# Altium project Salty32.PrjPcb
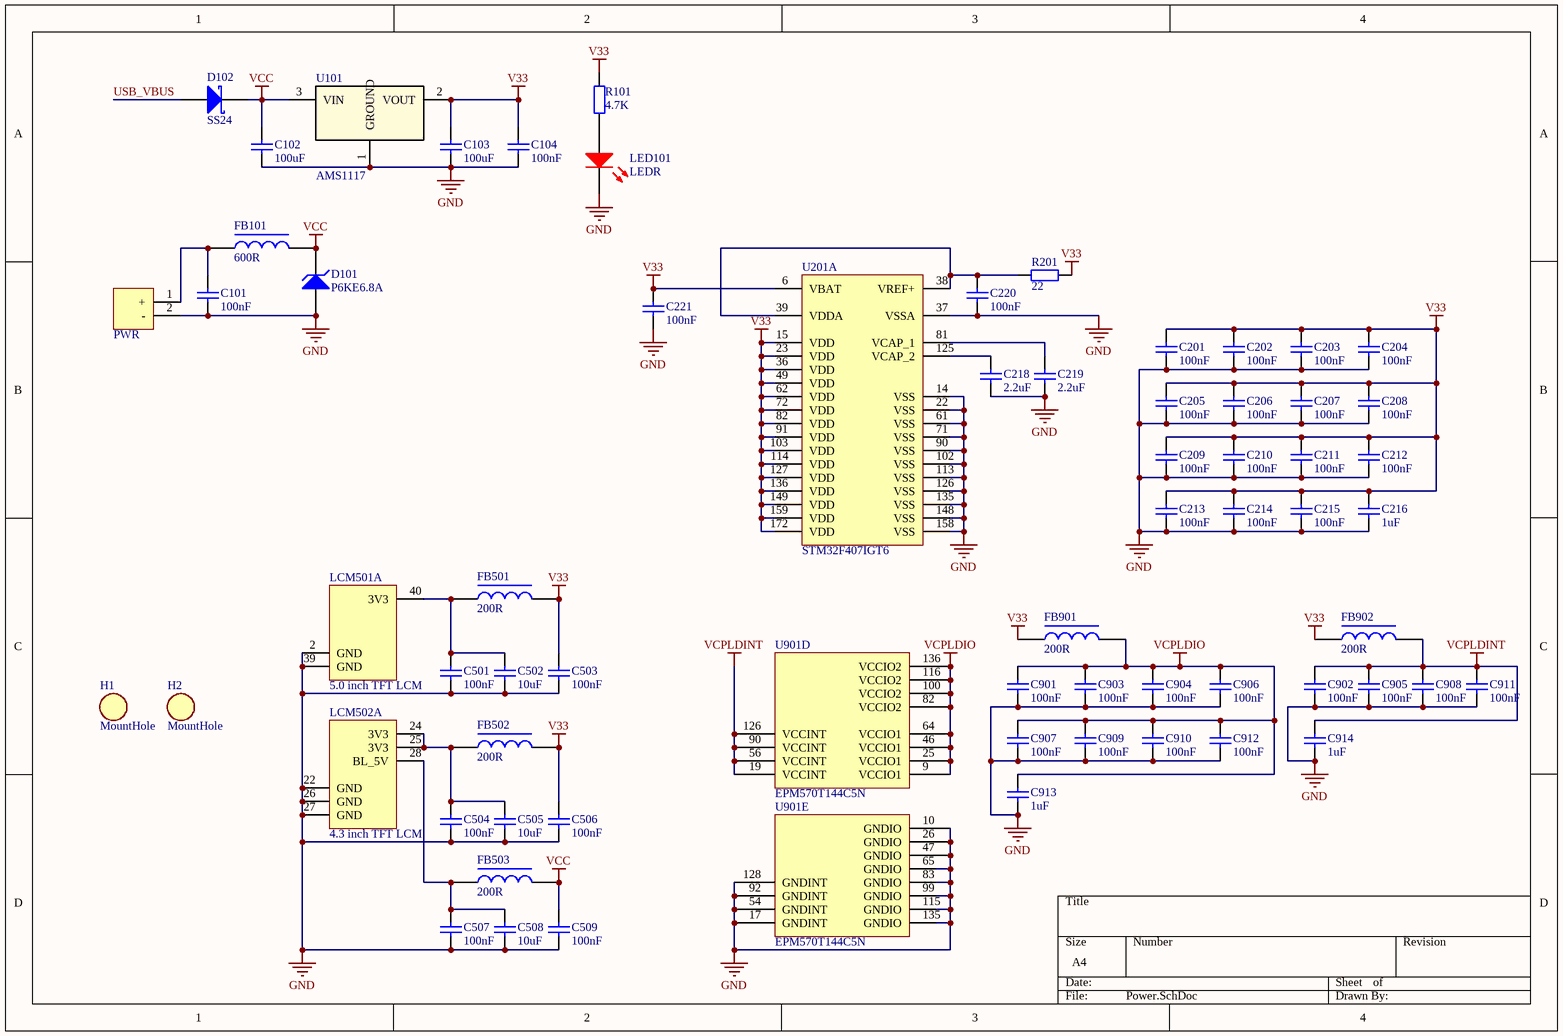
[diagram p0: Power.SchDoc]
7 sheets, 187 parts. Net scope: global (net labels, ports and power ports of the same name join across sheets).
Board file: Salty32.PcbDoc
Sheets:
  Power.SchDoc
  STM32.SchDoc
  FSMC.SchDoc
  Ports.SchDoc
  FPGAPort.SchDoc
  USB.SchDoc
  CPLD.SchDoc

## Sheet Power.SchDoc
size A4

### Parts
C101  value 100nF  [0603C]  (hidden comment: MLCC)
C102  value 100uF  [1210C]  (hidden comment: MLCC)
C103  value 100uF  [1210C]  (hidden comment: MLCC)
C104  value 100nF  [0805C]  (hidden comment: MLCC)
C201  value 100nF  [0603C]  (hidden comment: MLCC)
C202  value 100nF  [0603C]  (hidden comment: MLCC)
C203  value 100nF  [0603C]  (hidden comment: MLCC)
C204  value 100nF  [0603C]  (hidden comment: MLCC)
C205  value 100nF  [0603C]  (hidden comment: MLCC)
C206  value 100nF  [0603C]  (hidden comment: MLCC)
C207  value 100nF  [0603C]  (hidden comment: MLCC)
C208  value 100nF  [0603C]  (hidden comment: MLCC)
C209  value 100nF  [0603C]  (hidden comment: MLCC)
C210  value 100nF  [0603C]  (hidden comment: MLCC)
C211  value 100nF  [0603C]  (hidden comment: MLCC)
C212  value 100nF  [0603C]  (hidden comment: MLCC)
C213  value 100nF  [0603C]  (hidden comment: MLCC)
C214  value 100nF  [0603C]  (hidden comment: MLCC)
C215  value 100nF  [0603C]  (hidden comment: MLCC)
C216  value 1uF  [0805C]  (hidden comment: MLCC)
C218  value 2.2uF  [0805C]  (hidden comment: MLCC)
C219  value 2.2uF  [0805C]  (hidden comment: MLCC)
C220  value 100nF  [0603C]  (hidden comment: MLCC)
C221  value 100nF  [0603C]  (hidden comment: MLCC)
C501  value 100nF  [0805C]  (hidden comment: MLCC)
C502  value 10uF  [0805C]  (hidden comment: MLCC)
C503  value 100nF  [0805C]  (hidden comment: MLCC)
C504  value 100nF  [0805C]  (hidden comment: MLCC)
C505  value 10uF  [0805C]  (hidden comment: MLCC)
C506  value 100nF  [0805C]  (hidden comment: MLCC)
C507  value 100nF  [0805C]  (hidden comment: MLCC)
C508  value 10uF  [0805C]  (hidden comment: MLCC)
C509  value 100nF  [0805C]  (hidden comment: MLCC)
C901  value 100nF  [0603C]  (hidden comment: MLCC)
C902  value 100nF  [0603C]  (hidden comment: MLCC)
C903  value 100nF  [0603C]  (hidden comment: MLCC)
C904  value 100nF  [0603C]  (hidden comment: MLCC)
C905  value 100nF  [0603C]  (hidden comment: MLCC)
C906  value 100nF  [0603C]  (hidden comment: MLCC)
C907  value 100nF  [0603C]  (hidden comment: MLCC)
C908  value 100nF  [0603C]  (hidden comment: MLCC)
C909  value 100nF  [0603C]  (hidden comment: MLCC)
C910  value 100nF  [0603C]  (hidden comment: MLCC)
C911  value 100nF  [0603C]  (hidden comment: MLCC)
C912  value 100nF  [0603C]  (hidden comment: MLCC)
C913  value 1uF  [0805C]  (hidden comment: MLCC)
C914  value 1uF  [0805C]  (hidden comment: MLCC)
D101  P6KE6.8A  [SMB]
D102  SS24  [SMA]
FB101  value 600R  [1206L]  (hidden comment: FerriteBead)
FB501  value 200R  [0805L]  (hidden comment: FerriteBead)
FB502  value 200R  [0805L]  (hidden comment: FerriteBead)
FB503  value 200R  [0805L]  (hidden comment: FerriteBead)
FB901  value 200R  [0805L]  (hidden comment: FerriteBead)
FB902  value 200R  [0805L]  (hidden comment: FerriteBead)
H1  MountHole  [MOUNTHOLE]
H2  MountHole  [MOUNTHOLE]
LCM501  5.0 inch TFT LCM  [LCM5.0]  (part A of 3)
LCM502  4.3 inch TFT LCM  [LCM4.3_ATK]  (part A of 3)
LED101  LEDR  [LED1206R]
PWR  WPORT2_PWR  [VH3.96-POWER-2P]  (value not drawn)
R101  value 4.7K  [0603R]  (hidden comment: Resistor)
R201  value 22  [0603R]  (hidden comment: Resistor)
U101  AMS1117  [DCY4]
U201  STM32F407IGT6  [STM-LQFP176_N]  (part A of 7)
U901  EPM570T144C5N  [TQFP144_N]  (parts D,E of 5)

### Nets
GND: C101.1 C102.1 C103.1 C104.1 C201.1 C202.1 C203.1 C204.1 C205.1 C206.1 C207.1 C208.1 C209.1 C210.1 C211.1 C212.1 C213.1 C214.1 C215.1 C216.1 C218.1 C219.1 C220.1 C221.1 C501.1 C502.1 C503.1 C504.1 C505.1 C506.1 C507.1 C508.1 C509.1 C901.1 C902.1 C903.1 C904.1 C905.1 C906.1 C907.1 C908.1 C909.1 C910.1 C911.1 C912.1 C913.1 C914.1 D101.1(A) LCM501.2(GND) LCM501.39(GND) LCM502.22(GND) LCM502.26(GND) LCM502.27(GND) LED101.2(K) PWR.2(-) U101.1(GROUND) U201.14(VSS) U201.22(VSS) U201.37(VSSA) U201.61(VSS) U201.71(VSS) U201.90(VSS) U201.102(VSS) U201.113(VSS) U201.126(VSS) U201.135(VSS) U201.148(VSS) U201.158(VSS) U901.10(GNDIO) U901.17(GNDINT) U901.26(GNDIO) U901.47(GNDIO) U901.54(GNDINT) U901.65(GNDIO) U901.83(GNDIO) U901.92(GNDINT) U901.99(GNDIO) U901.115(GNDIO) U901.128(GNDINT) U901.135(GNDIO)
V33: C103.2 C104.2 C201.2 C202.2 C203.2 C204.2 C205.2 C206.2 C207.2 C208.2 C209.2 C210.2 C211.2 C212.2 C213.2 C214.2 C215.2 C216.2 C221.2 C503.2 C506.2 FB501.2 FB502.2 FB901.1 FB902.1 R101.2 R201.2 U101.2(VOUT) U201.6(VBAT) U201.15(VDD) U201.23(VDD) U201.36(VDD) U201.49(VDD) U201.62(VDD) U201.72(VDD) U201.82(VDD) U201.91(VDD) U201.103(VDD) U201.114(VDD) U201.127(VDD) U201.136(VDD) U201.149(VDD) U201.159(VDD) U201.172(VDD)
VCC: C102.2 C509.2 D101.2(K) D102.2(K) FB101.2 FB503.2 U101.3(VIN)
VCPLDINT: C902.2 C905.2 C908.2 C911.2 C914.2 FB902.2 U901.19(VCCINT) U901.56(VCCINT) U901.90(VCCINT) U901.126(VCCINT)
VCPLDIO: C901.2 C903.2 C904.2 C906.2 C907.2 C909.2 C910.2 C912.2 C913.2 FB901.2 U901.9(VCCIO1) U901.25(VCCIO1) U901.46(VCCIO1) U901.64(VCCIO1) U901.82(VCCIO2) U901.100(VCCIO2) U901.116(VCCIO2) U901.136(VCCIO2)
USB_VBUS: D102.1(A)
NetC101_2: C101.2 FB101.1 PWR.1(+)
NetC218_2: C218.2 U201.125(VCAP_2)
NetC219_2: C219.2 U201.81(VCAP_1)
NetC220_2: C220.2 R201.1 U201.38(VREF+) U201.39(VDDA)
NetC501_2: C501.2 C502.2 FB501.1 LCM501.40(3V3)
NetC504_2: C504.2 C505.2 FB502.1 LCM502.24(3V3) LCM502.25(3V3)
NetC507_2: C507.2 C508.2 FB503.1 LCM502.28(BL_5V)
NetLED101_1: LED101.1(A) R101.1

### Library data of the parts
D101 = P6KE6.8A: 600 Watt Peak Power Surmetict-40 Zener TransientVoltage Suppressors
D102 = SS24: Schottky Rectifier
H1 H2 = MountHole: 3mm mount hole
LCM501 = LCM5.0
LCM502 = LCM4.3_ATK
LED101 = LEDR: RED LED
PWR = WPORT2_PWR: 2 pin power port
U101 = AMS1117: 800mA LOW DROPOUT VOLTAGE REGULATOR
U201 = STM32F407IGT6: ARM Cortex-M4 32-bit MCU+FPU, 210 DMIPS, 1024 kB Flash, 192 kB Internal RAM, 140 I/Os, 176-pin LQFP, -40 to 85 degC, Tray; Manufacturer: STMicroelectronics; D/A Converter: 2x12-bit; FLASH Size (Prog) (kB): 1024; I/Os (High Current): 140; Internal RAM Size (kB): 192; Operating Frequency(F) (Processor speed) (MHz): 168; Supply Voltage(Vcc) max (V): 3.6; Supply Voltage(Vcc) min (V): 1.8; DatasheetVersion: Rev. 4; PackageVersion: Rev. 4, 06/2013; PackageReference: LQFP176; PackageDescription: 176-Pin Low Profile Quad Flat Package, 24 x 24 mm Body, 0.5 mm Pitch; Supplier 1: Digi-Key; Supplier Part Number 1: 497-11604-ND; Supplier 2: Farnell; Supplier Part Number 2: 2064366; Supplier 3: Newark; Supplier Part Number 3: 73T2331; Supplier 4: Mouser; Supplier Part Number 4: 511-STM32F407IGT6; Core: ARM Cortex-M4; Packing: Tray; Mounting Technology: Surface Mount; PartNumber: STM32F407IGT6; ComponentLink1Description: Manufacturer URL; ComponentLink1URL: http://www.st.com/web/en/home.html; ComponentLink2Description: Datasheet; ComponentLink2URL: http://www.st.com/st-web-ui/static/active/en/resource/technical/document/datasheet/DM00037051.pdf; ComponentLink3Description: Package Specification; ComponentLink3URL: http://www.st.com/st-web-ui/static/active/en/resource/technical/document/datasheet/DM00035129.pdf
U901 = EPM570T144C5N: MAX II 3.3/2.5V CPLD, 116 IOs, 570 Logic Elements, 144-Pin Plastic TQFP, Commercial Temperature, Speed Grade 5, Pb-Free; Note: Each set of VCCIO pins can be connected to 3.3V, 2.5V, 1.8V, or 1.5V.; Note: All VCCINT pins must be connected to either 3.3V or 2.5V (but not a combination of both).; DatasheetVersion: ver1.8, Jul-2006; PackageVersion: ver16.3, Dec-2010; PackageReference: TQFP144; PackageDescription: 144-Pin Plastic Thin Quad Flat Pack (TQFP144) - Wire Bond; Code_JEDEC: MS-026-BFB; ComponentLink1Description: Manufacturer URL; ComponentLink1URL: http://www.altera.com/; ComponentLink2Description: Handbook; ComponentLink2URL: http://www.altera.com/literature/hb/max2/max2_mii5v1.pdf; ComponentLink3Description: Package Specification; ComponentLink3URL: http://www.altera.com/literature/ds/dspkg.pdf

## Sheet STM32.SchDoc
size A3
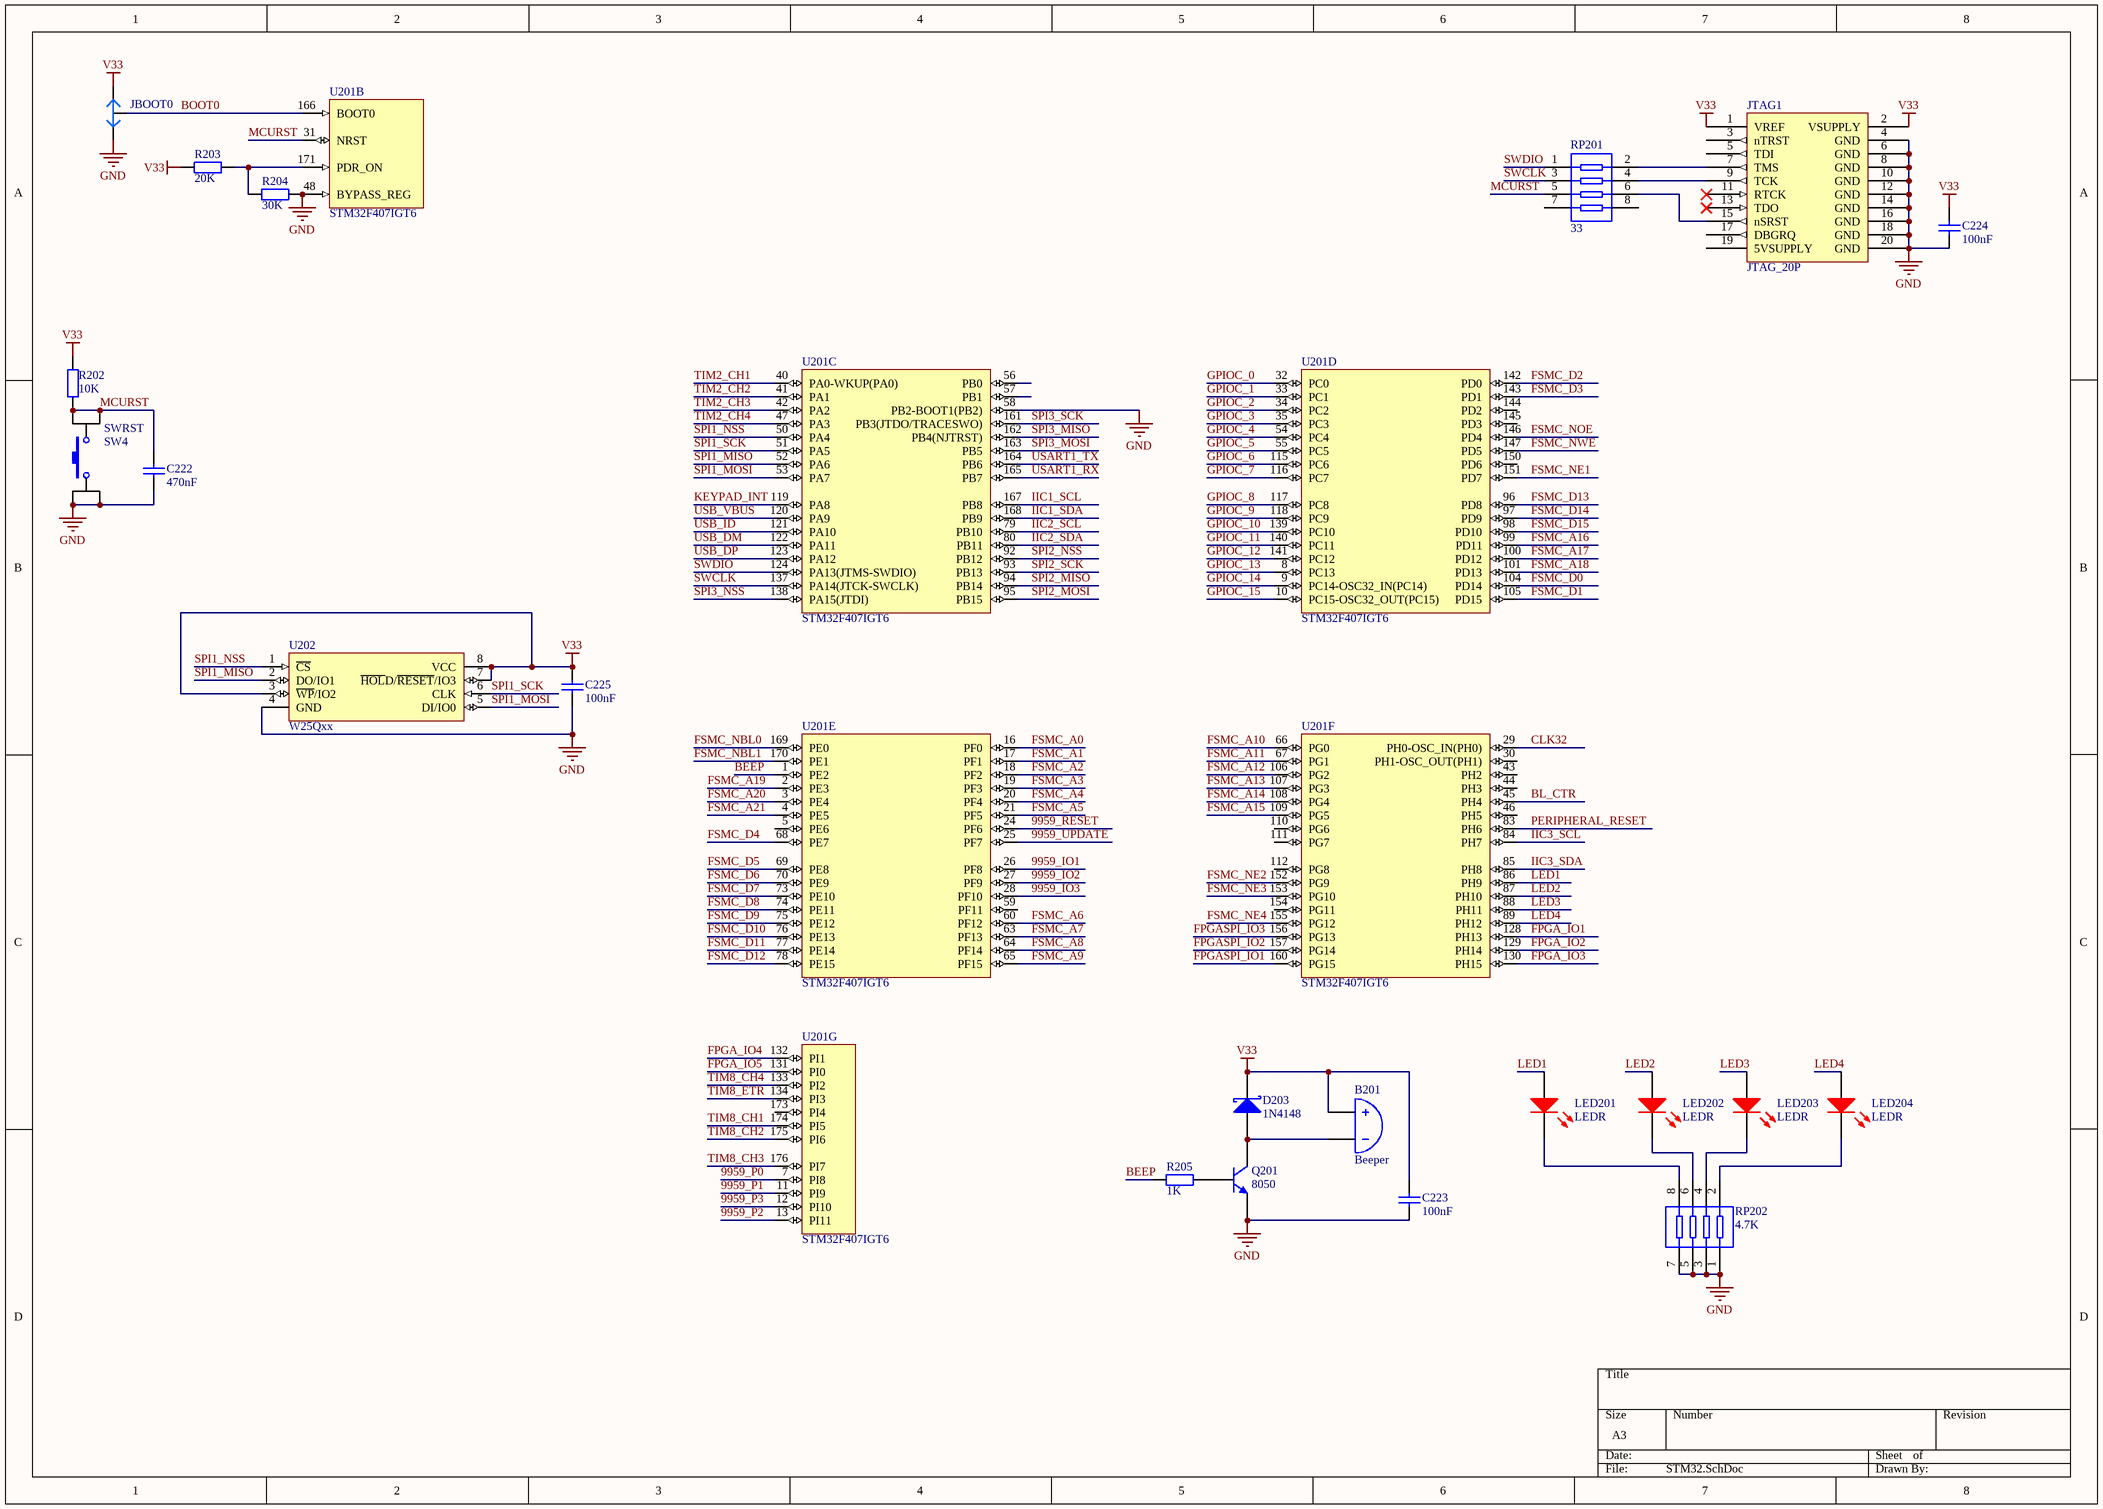
[diagram p1: STM32.SchDoc]

### Parts
B201  Beeper  [BEEPER]
C222  value 470nF  [0603C]  (hidden comment: MLCC)
C223  value 100nF  [0603C]  (hidden comment: MLCC)
C224  value 100nF  [0805C]  (hidden comment: MLCC)
C225  value 100nF  [0603C]  (hidden comment: MLCC)
D203  1N4148  [SOD323]
JBOOT0  Switch_2Ch_Line  [SWITCH_2CH_LINE]  (value not drawn)
JTAG1  JTAG_20P  [JTAG20]
LED201  LEDR  [LED1206R]
LED202  LEDR  [LED1206R]
LED203  LEDR  [LED1206R]
LED204  LEDR  [LED1206R]
Q201  8050  [SOT-23]
R202  value 10K  [0603R]  (hidden comment: Resistor)
R203  value 20K  [0603R]  (hidden comment: Resistor)
R204  value 30K  [0603R]  (hidden comment: Resistor)
R205  value 1K  [0603R]  (hidden comment: Resistor)
RP201  value 33  [8P4R_0603]  (hidden comment: Res Pack)
RP202  value 4.7K  [8P4R_0603]  (hidden comment: Res Pack)
SWRST  SW4  [SW-0606]
U201  STM32F407IGT6  [STM-LQFP176_N]  (parts B,C,D,E,F,G of 7)
U202  W25Qxx  [W25Qxx]

### Nets
GND: C222.1 C223.1 C224.1 C225.1 JBOOT0.3 JTAG1.4(GND) JTAG1.6(GND) JTAG1.8(GND) JTAG1.10(GND) JTAG1.12(GND) JTAG1.14(GND) JTAG1.16(GND) JTAG1.18(GND) JTAG1.20(GND) Q201.2(E) R204.2 RP202.1 RP202.3 RP202.5 RP202.7 SWRST.2 SWRST.4 U201.48(BYPASS_REG) U201.58(PB2-BOOT1(PB2)) U202.4(GND)
V33: B201.1(A) C223.2 C224.2 C225.2 D203.2(K) JBOOT0.2 JTAG1.1(VREF) JTAG1.2(VSUPPLY) R202.2 R203.1 U202.3(~{WP}/IO2) U202.7(~{HOL}D/~{RESET}/IO3) U202.8(VCC)
9959_IO1: U201.26(PF8)
9959_IO2: U201.27(PF9)
9959_IO3: U201.28(PF10)
9959_P0: U201.7(PI8)
9959_P1: U201.11(PI9)
9959_P2: U201.13(PI11)
9959_P3: U201.12(PI10)
9959_RESET: U201.24(PF6)
9959_UPDATE: U201.25(PF7)
BEEP: R205.1 U201.1(PE2)
BL_CTR: U201.45(PH4)
BOOT0: JBOOT0.1 U201.166(BOOT0)
CLK32: U201.29(PH0-OSC_IN(PH0))
FPGA_IO1: U201.128(PH13)
FPGA_IO2: U201.129(PH14)
FPGA_IO3: U201.130(PH15)
FPGA_IO4: U201.132(PI1)
FPGA_IO5: U201.131(PI0)
FPGASPI_IO1: U201.160(PG15)
FPGASPI_IO2: U201.157(PG14)
FPGASPI_IO3: U201.156(PG13)
FSMC_A0: U201.16(PF0)
FSMC_A1: U201.17(PF1)
FSMC_A2: U201.18(PF2)
FSMC_A3: U201.19(PF3)
FSMC_A4: U201.20(PF4)
FSMC_A5: U201.21(PF5)
FSMC_A6: U201.60(PF12)
FSMC_A7: U201.63(PF13)
FSMC_A8: U201.64(PF14)
FSMC_A9: U201.65(PF15)
FSMC_A10: U201.66(PG0)
FSMC_A11: U201.67(PG1)
FSMC_A12: U201.106(PG2)
FSMC_A13: U201.107(PG3)
FSMC_A14: U201.108(PG4)
FSMC_A15: U201.109(PG5)
FSMC_A16: U201.99(PD11)
FSMC_A17: U201.100(PD12)
FSMC_A18: U201.101(PD13)
FSMC_A19: U201.2(PE3)
FSMC_A20: U201.3(PE4)
FSMC_A21: U201.4(PE5)
FSMC_D0: U201.104(PD14)
FSMC_D1: U201.105(PD15)
FSMC_D2: U201.142(PD0)
FSMC_D3: U201.143(PD1)
FSMC_D4: U201.68(PE7)
FSMC_D5: U201.69(PE8)
FSMC_D6: U201.70(PE9)
FSMC_D7: U201.73(PE10)
FSMC_D8: U201.74(PE11)
FSMC_D9: U201.75(PE12)
FSMC_D10: U201.76(PE13)
FSMC_D11: U201.77(PE14)
FSMC_D12: U201.78(PE15)
FSMC_D13: U201.96(PD8)
FSMC_D14: U201.97(PD9)
FSMC_D15: U201.98(PD10)
FSMC_NBL0: U201.169(PE0)
FSMC_NBL1: U201.170(PE1)
FSMC_NE1: U201.151(PD7)
FSMC_NE2: U201.152(PG9)
FSMC_NE3: U201.153(PG10)
FSMC_NE4: U201.155(PG12)
FSMC_NOE: U201.146(PD4)
FSMC_NWE: U201.147(PD5)
GPIOC_0: U201.32(PC0)
GPIOC_1: U201.33(PC1)
GPIOC_2: U201.34(PC2)
GPIOC_3: U201.35(PC3)
GPIOC_4: U201.54(PC4)
GPIOC_5: U201.55(PC5)
GPIOC_6: U201.115(PC6)
GPIOC_7: U201.116(PC7)
GPIOC_8: U201.117(PC8)
GPIOC_9: U201.118(PC9)
GPIOC_10: U201.139(PC10)
GPIOC_11: U201.140(PC11)
GPIOC_12: U201.141(PC12)
GPIOC_13: U201.8(PC13)
GPIOC_14: U201.9(PC14-OSC32_IN(PC14))
GPIOC_15: U201.10(PC15-OSC32_OUT(PC15))
IIC1_SCL: U201.167(PB8)
IIC1_SDA: U201.168(PB9)
IIC2_SCL: U201.79(PB10)
IIC2_SDA: U201.80(PB11)
IIC3_SCL: U201.84(PH7)
IIC3_SDA: U201.85(PH8)
KEYPAD_INT: U201.119(PA8)
LED1: LED201.1(A) U201.86(PH9)
LED2: LED202.1(A) U201.87(PH10)
LED3: LED203.1(A) U201.88(PH11)
LED4: LED204.1(A) U201.89(PH12)
MCURST: C222.2 R202.1 RP201.5 SWRST.1 SWRST.3 U201.31(NRST)
PERIPHERAL_RESET: U201.83(PH6)
SPI1_MISO: U201.52(PA6) U202.2(DO/IO1)
SPI1_MOSI: U201.53(PA7) U202.5(DI/IO0)
SPI1_NSS: U201.50(PA4) U202.1(~{CS})
SPI1_SCK: U201.51(PA5) U202.6(CLK)
SPI2_MISO: U201.94(PB14)  [project net 9959_IO0]
SPI2_MOSI: U201.95(PB15)
SPI2_NSS: U201.92(PB12)  [project net 9959_CS]
SPI2_SCK: U201.93(PB13)  [project net 9959_SCLK]
SPI3_MISO: U201.162(PB4(NJTRST))  [project net FPGASPI_MISO]
SPI3_MOSI: U201.163(PB5)  [project net FPGASPI_MOSI]
SPI3_NSS: U201.138(PA15(JTDI))  [project net FPGASPI_CS]
SPI3_SCK: U201.161(PB3(JTDO/TRACESWO))  [project net FPGASPI_SCK]
SWCLK: RP201.3 U201.137(PA14(JTCK-SWCLK))
SWDIO: RP201.1 U201.124(PA13(JTMS-SWDIO))
TIM2_CH1: U201.40(PA0-WKUP(PA0))
TIM2_CH2: U201.41(PA1)
TIM2_CH3: U201.42(PA2)
TIM2_CH4: U201.47(PA3)
TIM8_CH1: U201.174(PI5)
TIM8_CH2: U201.175(PI6)
TIM8_CH3: U201.176(PI7)
TIM8_CH4: U201.133(PI2)
TIM8_ETR: U201.134(PI3)
USART1_RX: U201.165(PB7)
USART1_TX: U201.164(PB6)
USB_DM: U201.122(PA11)
USB_DP: U201.123(PA12)
USB_ID: U201.121(PA10)
USB_VBUS: U201.120(PA9)
NetB201_2: B201.2(B) D203.1(A) Q201.3(C)
NetJTAG1_7: JTAG1.7(TMS) RP201.2
NetJTAG1_9: JTAG1.9(TCK) RP201.4
NetJTAG1_15: JTAG1.15(nSRST) RP201.6
NetLED201_2: LED201.2(K) RP202.8
NetLED202_2: LED202.2(K) RP202.6
NetLED203_2: LED203.2(K) RP202.4
NetLED204_2: LED204.2(K) RP202.2
NetQ201_1: Q201.1(B) R205.2
NetR203_2: R203.2 R204.1 U201.171(PDR_ON)

Not connected (* = marked no-connect by the designer): JTAG1 3(nTRST) 5(TDI) 11(RTCK)* 13(TDO)* 17(DBGRQ) 19(5VSUPPLY); RP201 7 8; U201 5(PE6) 30(PH1-OSC_OUT(PH1)) 43(PH2) 44(PH3) 46(PH5) 56(PB0) 57(PB1) 59(PF11) 110(PG6) 111(PG7) 112(PG8) 144(PD2) 145(PD3) 150(PD6) 154(PG11) 173(PI4)

### Library data of the parts
D203 = 1N4148: Small signal didoe
JTAG1 = JTAG_20P: 20 pin JTAG port
LED201-LED204 = LEDR: RED LED
Q201 = 8050: NPN Bipolar Transistor
RP201 RP202 = Res Pack: Isolated Resistor Network
SWRST = SW4: Switch
U201 = STM32F407IGT6: as U201 on sheet Power; DatasheetVersion: Rev. 4; PackageVersion: Rev. 4, 06/2013; PackageReference: LQFP176; PackageDescription: 176-Pin Low Profile Quad Flat Package, 24 x 24 mm Body, 0.5 mm Pitch; Supplier 1: Digi-Key; Supplier Part Number 1: 497-11604-ND; Supplier 2: Farnell; Supplier Part Number 2: 2064366; Supplier 3: Newark; Supplier Part Number 3: 73T2331; Supplier 4: Mouser; Supplier Part Number 4: 511-STM32F407IGT6; Core: ARM Cortex-M4; Packing: Tray; Mounting Technology: Surface Mount; PartNumber: STM32F407IGT6; ComponentLink1Description: Manufacturer URL; ComponentLink1URL: http://www.st.com/web/en/home.html; ComponentLink2Description: Datasheet; ComponentLink2URL: http://www.st.com/st-web-ui/static/active/en/resource/technical/document/datasheet/DM00037051.pdf; ComponentLink3Description: Package Specification; ComponentLink3URL: http://www.st.com/st-web-ui/static/active/en/resource/technical/document/datasheet/DM00035129.pdf
U202 = W25Qxx: 3V SERIAL FLASH MEMORY WITH DUAL/QUAD SPI & QPI

## Sheet FSMC.SchDoc
size A4
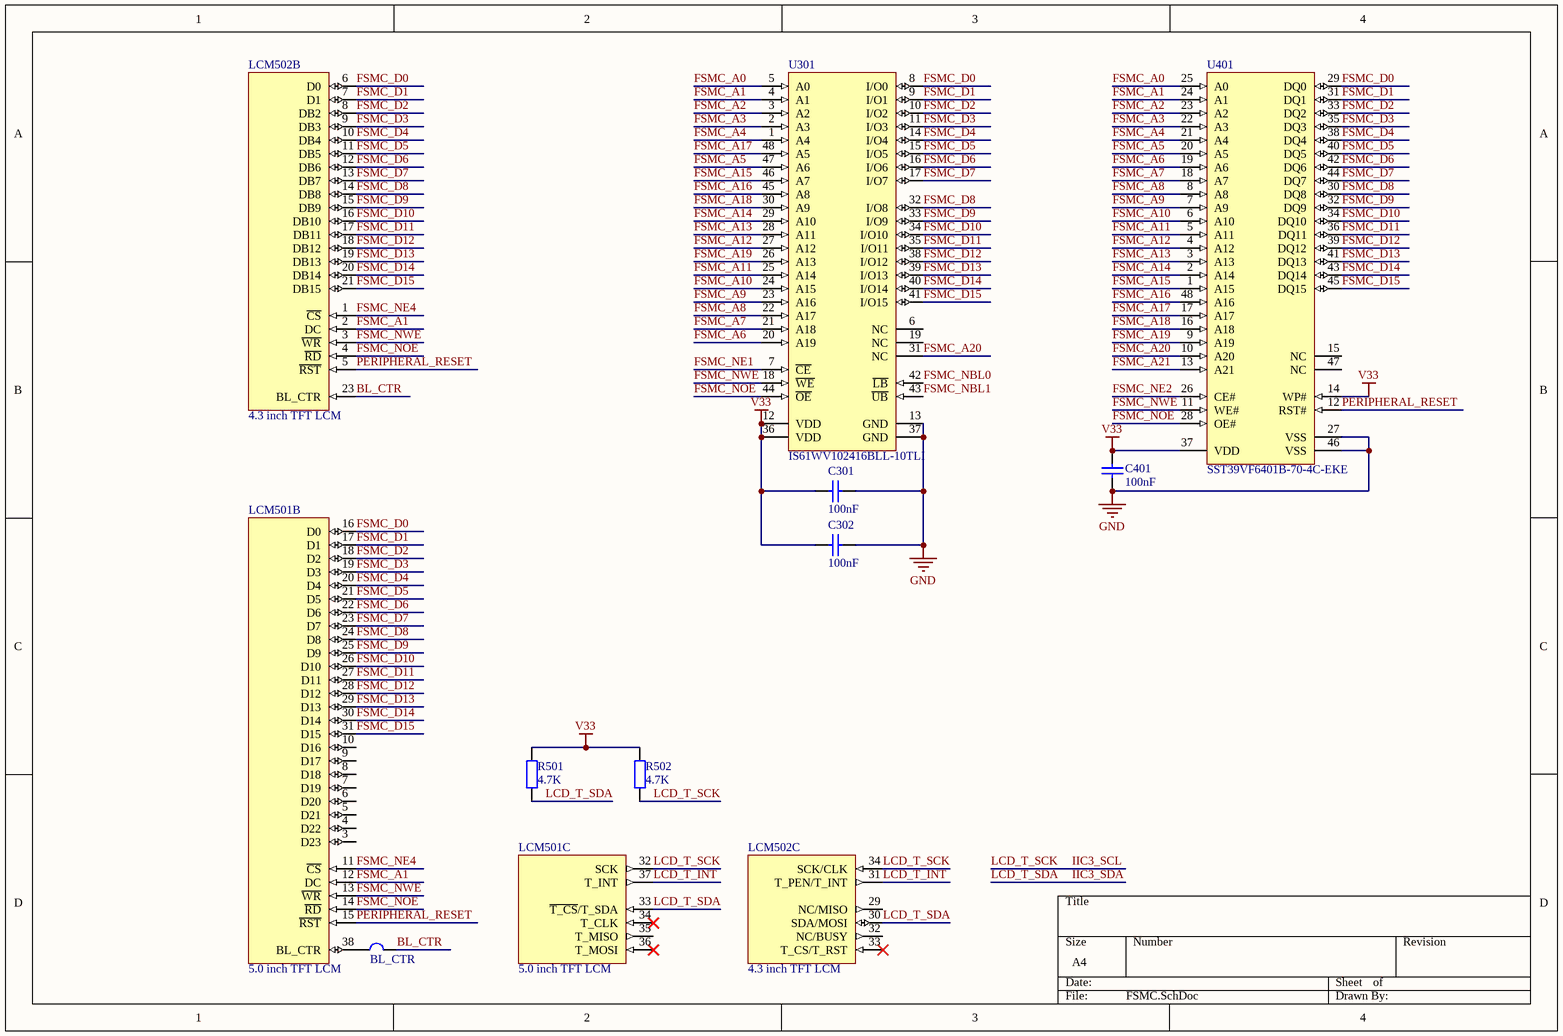
[diagram p2: FSMC.SchDoc]

### Parts
BL_CTR  Switch  [SWITCH]  (value not drawn)
C301  value 100nF  [0603C]  (hidden comment: MLCC)
C302  value 100nF  [0603C]  (hidden comment: MLCC)
C401  value 100nF  [0603C]  (hidden comment: MLCC)
LCM501  5.0 inch TFT LCM  [LCM5.0]  (parts B,C of 3)
LCM502  4.3 inch TFT LCM  [LCM4.3_ATK]  (parts B,C of 3)
R501  value 4.7K  [0603R]  (hidden comment: Resistor)
R502  value 4.7K  [0603R]  (hidden comment: Resistor)
U301  IS61WV102416BLL-10TLI  [ISSI-TSOP-1-48-12000X20000DE_N]
U401  SST39VF6401B-70-4C-EKE  [MCHP-TSOP-EK48_N]

### Nets
GND: C301.2 C302.2 C401.1 U301.13(GND) U301.37(GND) U401.27(VSS) U401.46(VSS)
V33: C301.1 C302.1 C401.2 R501.2 R502.2 U301.12(VDD) U301.36(VDD) U401.14(WP#) U401.37(VDD)
BL_CTR: BL_CTR.2 LCM502.23(BL_CTR)
FSMC_A0: U301.5(A0) U401.25(A0)
FSMC_A1: LCM501.12(DC) LCM502.2(DC) U301.4(A1) U401.24(A1)
FSMC_A2: U301.3(A2) U401.23(A2)
FSMC_A3: U301.2(A3) U401.22(A3)
FSMC_A4: U301.1(A4) U401.21(A4)
FSMC_A5: U301.47(A6) U401.20(A5)
FSMC_A6: U301.20(A19) U401.19(A6)
FSMC_A7: U301.21(A18) U401.18(A7)
FSMC_A8: U301.22(A17) U401.8(A8)
FSMC_A9: U301.23(A16) U401.7(A9)
FSMC_A10: U301.24(A15) U401.6(A10)
FSMC_A11: U301.25(A14) U401.5(A11)
FSMC_A12: U301.27(A12) U401.4(A12)
FSMC_A13: U301.28(A11) U401.3(A13)
FSMC_A14: U301.29(A10) U401.2(A14)
FSMC_A15: U301.46(A7) U401.1(A15)
FSMC_A16: U301.45(A8) U401.48(A16)
FSMC_A17: U301.48(A5) U401.17(A17)
FSMC_A18: U301.30(A9) U401.16(A18)
FSMC_A19: U301.26(A13) U401.9(A19)
FSMC_A20: U301.31(NC) U401.10(A20)
FSMC_A21: U401.13(A21)
FSMC_D0: LCM501.16(D0) LCM502.6(D0) U301.8(I/O0) U401.29(DQ0)
FSMC_D1: LCM501.17(D1) LCM502.7(D1) U301.9(I/O1) U401.31(DQ1)
FSMC_D2: LCM501.18(D2) LCM502.8(DB2) U301.10(I/O2) U401.33(DQ2)
FSMC_D3: LCM501.19(D3) LCM502.9(DB3) U301.11(I/O3) U401.35(DQ3)
FSMC_D4: LCM501.20(D4) LCM502.10(DB4) U301.14(I/O4) U401.38(DQ4)
FSMC_D5: LCM501.21(D5) LCM502.11(DB5) U301.15(I/O5) U401.40(DQ5)
FSMC_D6: LCM501.22(D6) LCM502.12(DB6) U301.16(I/O6) U401.42(DQ6)
FSMC_D7: LCM501.23(D7) LCM502.13(DB7) U301.17(I/O7) U401.44(DQ7)
FSMC_D8: LCM501.24(D8) LCM502.14(DB8) U301.32(I/O8) U401.30(DQ8)
FSMC_D9: LCM501.25(D9) LCM502.15(DB9) U301.33(I/O9) U401.32(DQ9)
FSMC_D10: LCM501.26(D10) LCM502.16(DB10) U301.34(I/O10) U401.34(DQ10)
FSMC_D11: LCM501.27(D11) LCM502.17(DB11) U301.35(I/O11) U401.36(DQ11)
FSMC_D12: LCM501.28(D12) LCM502.18(DB12) U301.38(I/O12) U401.39(DQ12)
FSMC_D13: LCM501.29(D13) LCM502.19(DB13) U301.39(I/O13) U401.41(DQ13)
FSMC_D14: LCM501.30(D14) LCM502.20(DB14) U301.40(I/O14) U401.43(DQ14)
FSMC_D15: LCM501.31(D15) LCM502.21(DB15) U301.41(I/O15) U401.45(DQ15)
FSMC_NBL0: U301.42(~{LB})
FSMC_NBL1: U301.43(~{UB})
FSMC_NE1: U301.7(~{CE})
FSMC_NE2: U401.26(CE#)
FSMC_NE4: LCM501.11(~{CS}) LCM502.1(~{CS})
FSMC_NOE: LCM501.14(~{RD}) LCM502.4(~{RD}) U301.44(~{OE}) U401.28(OE#)
FSMC_NWE: LCM501.13(~{WR}) LCM502.3(~{WR}) U301.18(~{WE}) U401.11(WE#)
IIC3_SCL: LCM501.32(SCK) LCM502.34(SCK/CLK) R502.1  [also labelled LCD_T_SCK]
IIC3_SDA: LCM501.33(~{T_CS}/T_SDA) LCM502.30(SDA/MOSI) R501.1  [also labelled LCD_T_SDA]
LCD_T_INT: LCM501.37(T_INT) LCM502.31(T_PEN/T_INT)
PERIPHERAL_RESET: LCM501.15(~{RST}) LCM502.5(~{RST}) U401.12(RST#)
NetBL_CTR_1: BL_CTR.1 LCM501.38(BL_CTR)

Not connected (* = marked no-connect by the designer): LCM501 3(D23) 4(D22) 5(D21) 6(D20) 7(D19) 8(D18) 9(D17) 10(D16) 34(T_CLK)* 35(T_MISO) 36(T_MOSI)*; LCM502 29(NC/MISO) 32(NC/BUSY) 33(T_CS/T_RST)*; U301 6(NC) 19(NC); U401 15(NC) 47(NC)

### Library data of the parts
LCM501 = LCM5.0
LCM502 = LCM4.3_ATK
U301 = CMP-0513-00250-1: 16 M High Speed Asynchronous CMOS SRAM with 3.3 V Supply, 1 M x 16, -40 to 85 degC, 48-Pin SOP (TSOP-1-48), Pb-Free; Manufacturer: Integrated Silicon Solution Inc (ISSI); Organization: 1M x 16; Density: 16M; Packing: Tray / Tube; Speed (ns): 10; ComponentLink1Description: Manufacturer URL; ComponentLink2Description: Datasheet; ComponentLink2URL: http://www.issi.com/WW/pdf/61WV102416ALL.pdf; PackageDescription: 48-Pin 12 x 20 mm TSOP-1, Pitch 0.5 mm; RoHS: Pb-Free; ComponentLink3Description: Package Specification; ComponentLink1URL: http://www.issi.com/US/index.shtml; PackageReference: TSOP-1-48; ComponentLink3URL: http://www.issi.com/WW/pdf/61WV102416ALL.pdf; PackageVersion: Rev. B, 07/2006; PartNumber: IS61WV102416BLL-10TLI; DatasheetVersion: Rev. F; Mounting Technology: Surface Mount
U401 = CMP-0378-00196-1: 64 Mbit Multi-Purpose Flash Plus, 2.7 to 3.6 V, 0 to 70 degC, 48-pin TSOP (EK48), Tray; Manufacturer: Microchip; PackageDescription: 48-Lead Thin Small Outline Package, 18.4 x 12 mm Body, 0.5 mm Pitch; ComponentLink3Description: Package Specification; Code_JEDEC: MO-142; ComponentLink2Description: Datasheet; ComponentLink3URL: http://ww1.microchip.com/downloads/en/DeviceDoc/25008A.pdf; PackageReference: TSOP-EK48; PackageVersion: Rev. A; PartNumber: SST39VF6401B-70-4C-EKE; ComponentLink4URL: http://www.microchip.com/SST39VF6401B; ComponentLink4Description: Product URL; DatasheetVersion: Rev. A; ComponentLink1Description: Manufacturer URL; Mounting Technology: Surface Mount; ComponentLink2URL: http://ww1.microchip.com/downloads/en/DeviceDoc/25008A.pdf; ComponentLink1URL: http://www.microchip.com

## Sheet Ports.SchDoc
size A3
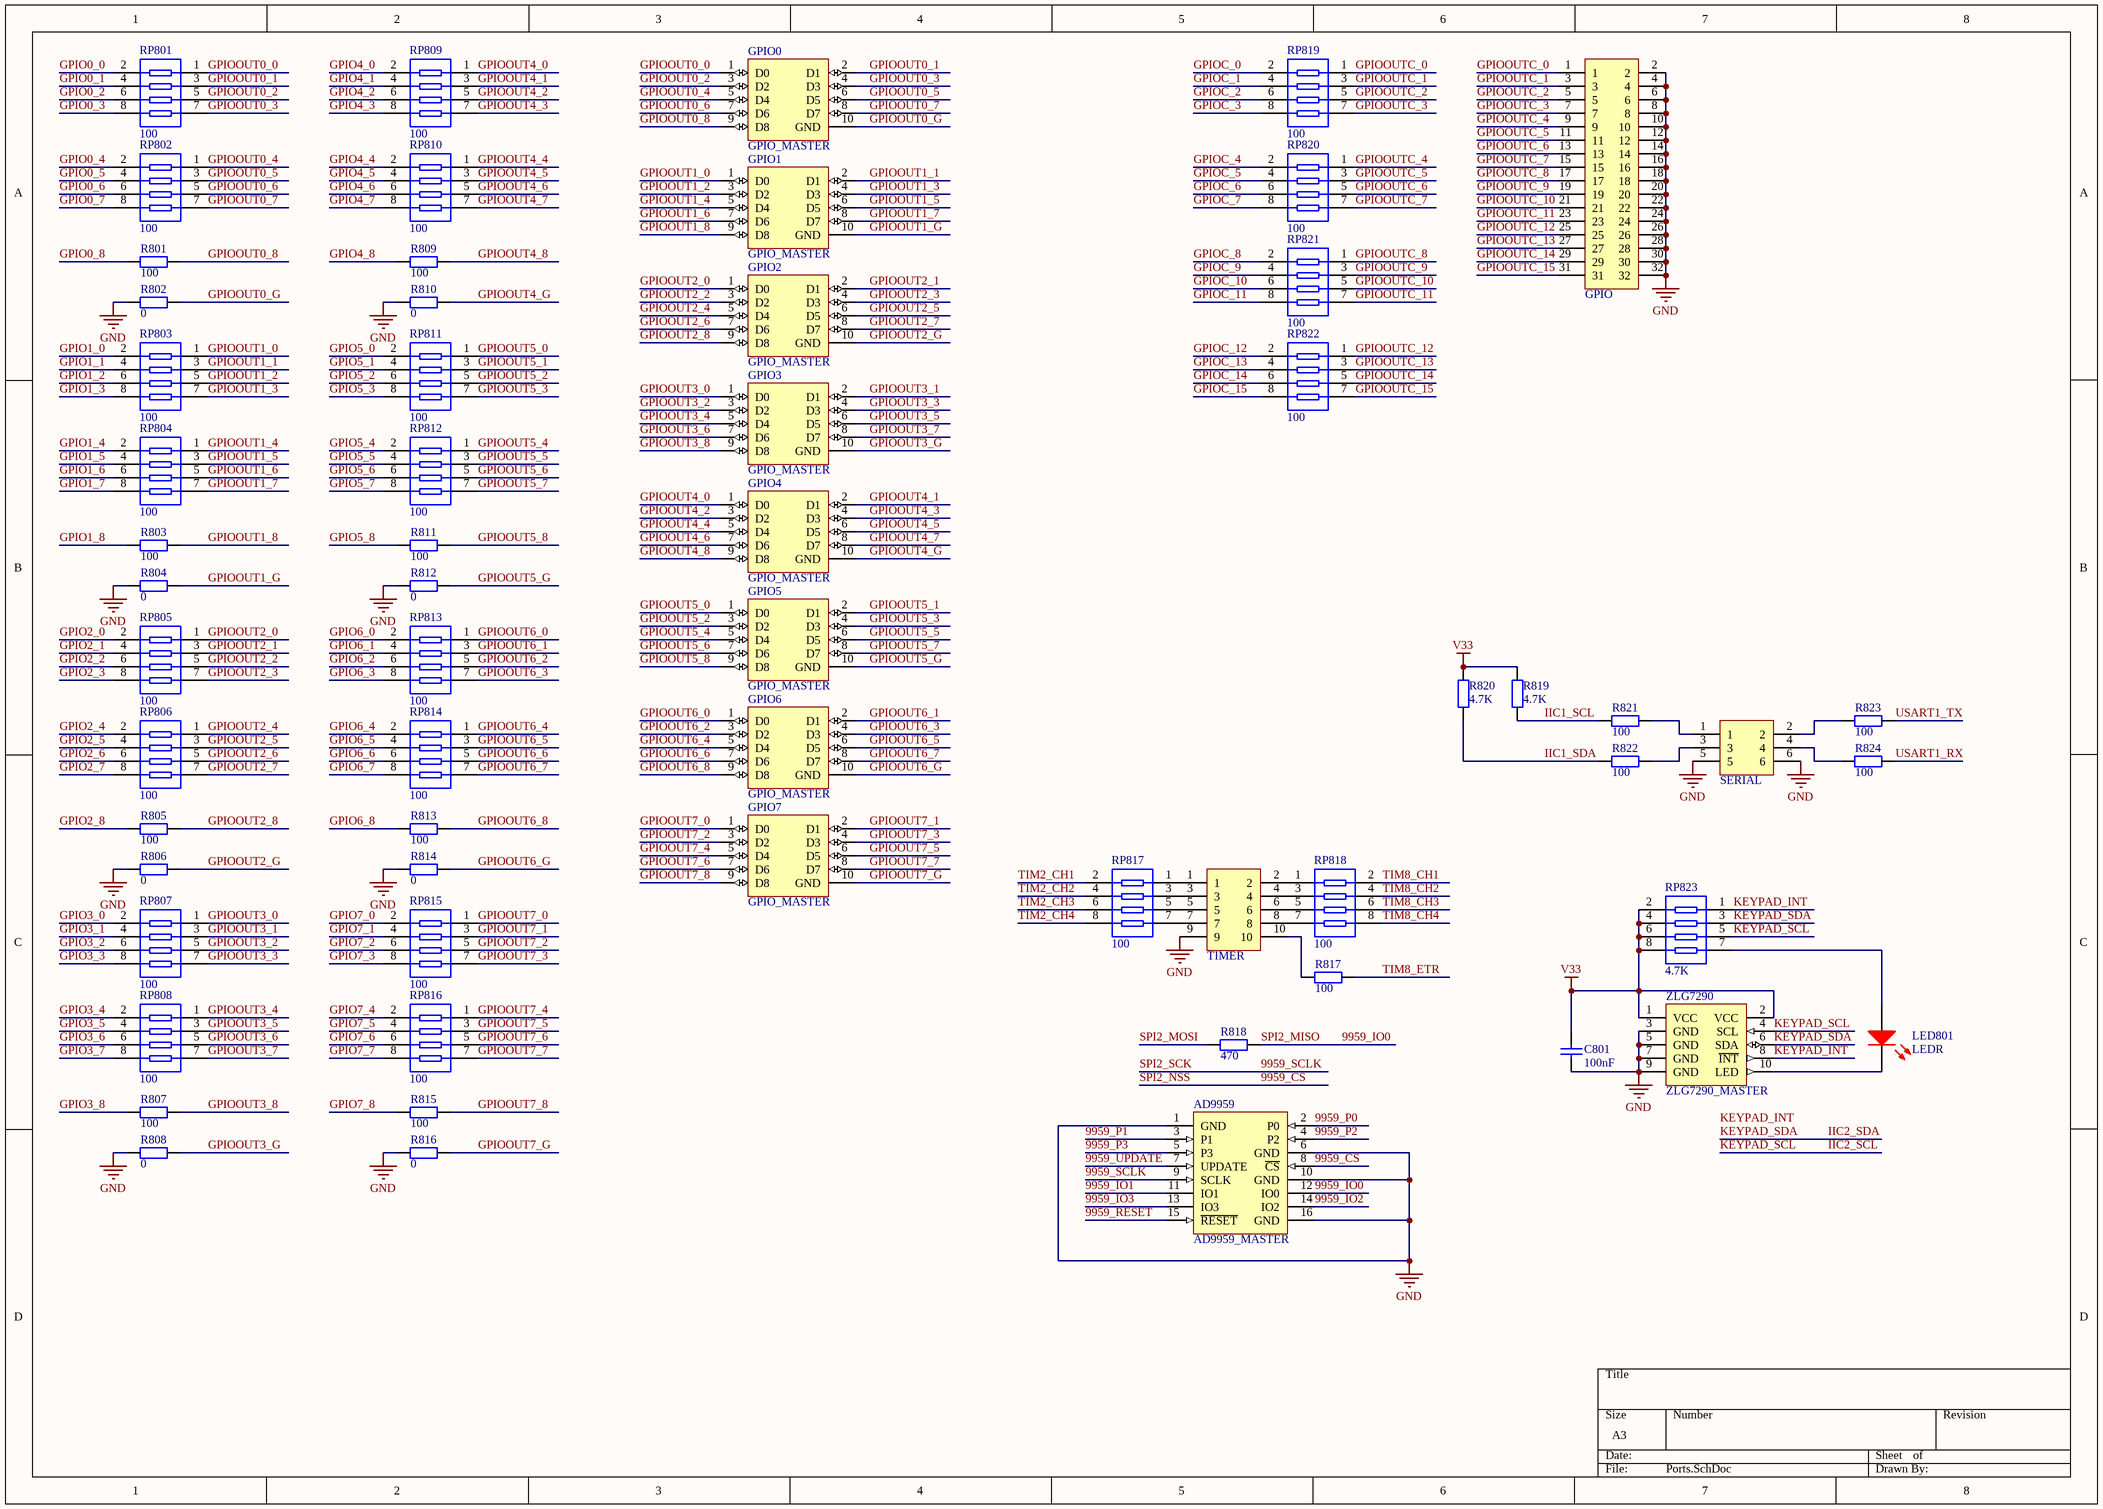
[diagram p3: Ports.SchDoc]

### Parts
AD9959  AD9959_MASTER  [IDC16]
C801  value 100nF  [0805C]  (hidden comment: MLCC)
GPIO  Dual 16 pin port  [201S2X16]  (value not drawn)
GPIO0  GPIO_MASTER  [IDC10]
GPIO1  GPIO_MASTER  [IDC10]
GPIO2  GPIO_MASTER  [IDC10]
GPIO3  GPIO_MASTER  [IDC10]
GPIO4  GPIO_MASTER  [IDC10]
GPIO5  GPIO_MASTER  [IDC10]
GPIO6  GPIO_MASTER  [IDC10]
GPIO7  GPIO_MASTER  [IDC10]
LED801  LEDR  [LED1206R]
R801  value 100  [0603R]  (hidden comment: Resistor)
R802  value 0  [0603R]  (hidden comment: Resistor)
R803  value 100  [0603R]  (hidden comment: Resistor)
R804  value 0  [0603R]  (hidden comment: Resistor)
R805  value 100  [0603R]  (hidden comment: Resistor)
R806  value 0  [0603R]  (hidden comment: Resistor)
R807  value 100  [0603R]  (hidden comment: Resistor)
R808  value 0  [0603R]  (hidden comment: Resistor)
R809  value 100  [0603R]  (hidden comment: Resistor)
R810  value 0  [0603R]  (hidden comment: Resistor)
R811  value 100  [0603R]  (hidden comment: Resistor)
R812  value 0  [0603R]  (hidden comment: Resistor)
R813  value 100  [0603R]  (hidden comment: Resistor)
R814  value 0  [0603R]  (hidden comment: Resistor)
R815  value 100  [0603R]  (hidden comment: Resistor)
R816  value 0  [0603R]  (hidden comment: Resistor)
R817  value 100  [0603R]  (hidden comment: Resistor)
R818  value 470  [0603R]  (hidden comment: Resistor)
R819  value 4.7K  [0603R]  (hidden comment: Resistor)
R820  value 4.7K  [0603R]  (hidden comment: Resistor)
R821  value 100  [0603R]  (hidden comment: Resistor)
R822  value 100  [0603R]  (hidden comment: Resistor)
R823  value 100  [0603R]  (hidden comment: Resistor)
R824  value 100  [0603R]  (hidden comment: Resistor)
RP801  value 100  [8P4R_0603]  (hidden comment: Res Pack)
RP802  value 100  [8P4R_0603]  (hidden comment: Res Pack)
RP803  value 100  [8P4R_0603]  (hidden comment: Res Pack)
RP804  value 100  [8P4R_0603]  (hidden comment: Res Pack)
RP805  value 100  [8P4R_0603]  (hidden comment: Res Pack)
RP806  value 100  [8P4R_0603]  (hidden comment: Res Pack)
RP807  value 100  [8P4R_0603]  (hidden comment: Res Pack)
RP808  value 100  [8P4R_0603]  (hidden comment: Res Pack)
RP809  value 100  [8P4R_0603]  (hidden comment: Res Pack)
RP810  value 100  [8P4R_0603]  (hidden comment: Res Pack)
RP811  value 100  [8P4R_0603]  (hidden comment: Res Pack)
RP812  value 100  [8P4R_0603]  (hidden comment: Res Pack)
RP813  value 100  [8P4R_0603]  (hidden comment: Res Pack)
RP814  value 100  [8P4R_0603]  (hidden comment: Res Pack)
RP815  value 100  [8P4R_0603]  (hidden comment: Res Pack)
RP816  value 100  [8P4R_0603]  (hidden comment: Res Pack)
RP817  value 100  [8P4R_0603]  (hidden comment: Res Pack)
RP818  value 100  [8P4R_0603]  (hidden comment: Res Pack)
RP819  value 100  [8P4R_0603]  (hidden comment: Res Pack)
RP820  value 100  [8P4R_0603]  (hidden comment: Res Pack)
RP821  value 100  [8P4R_0603]  (hidden comment: Res Pack)
RP822  value 100  [8P4R_0603]  (hidden comment: Res Pack)
RP823  value 4.7K  [8P4R_0603]  (hidden comment: Res Pack)
SERIAL  Dual 3 pin port  [201S2X3]  (value not drawn)
TIMER  IDC10  [IDC10]  (value not drawn)
ZLG7290  ZLG7290_MASTER  [IDC10]

### Nets
GND: AD9959.1(GND) AD9959.6(GND) AD9959.10(GND) AD9959.16(GND) C801.1 GPIO.2 GPIO.4 GPIO.6 GPIO.8 GPIO.10 GPIO.12 GPIO.14 GPIO.16 GPIO.18 GPIO.20 GPIO.22 GPIO.24 GPIO.26 GPIO.28 GPIO.30 GPIO.32 R802.1 R804.1 R806.1 R808.1 R810.1 R812.1 R814.1 R816.1 SERIAL.5 SERIAL.6 TIMER.9 ZLG7290.3(GND) ZLG7290.5(GND) ZLG7290.7(GND) ZLG7290.9(GND)
V33: C801.2 R819.2 R820.2 RP823.2 RP823.4 RP823.6 RP823.8 ZLG7290.1(VCC) ZLG7290.2(VCC)
9959_CS: AD9959.8(~{CS})  [also labelled SPI2_NSS]
9959_IO0: AD9959.12(IO0) R818.2  [also labelled SPI2_MISO]
9959_IO1: AD9959.11(IO1)
9959_IO2: AD9959.14(IO2)
9959_IO3: AD9959.13(IO3)
9959_P0: AD9959.2(P0)
9959_P1: AD9959.3(P1)
9959_P2: AD9959.4(P2)
9959_P3: AD9959.5(P3)
9959_RESET: AD9959.15(~{RESET})
9959_SCLK: AD9959.9(SCLK)  [also labelled SPI2_SCK]
9959_UPDATE: AD9959.7(UPDATE)
GPIO0_0: RP801.2
GPIO0_1: RP801.4
GPIO0_2: RP801.6
GPIO0_3: RP801.8
GPIO0_4: RP802.2
GPIO0_5: RP802.4
GPIO0_6: RP802.6
GPIO0_7: RP802.8
GPIO0_8: R801.1
GPIO1_0: RP803.2
GPIO1_1: RP803.4
GPIO1_2: RP803.6
GPIO1_3: RP803.8
GPIO1_4: RP804.2
GPIO1_5: RP804.4
GPIO1_6: RP804.6
GPIO1_7: RP804.8
GPIO1_8: R803.1
GPIO2_0: RP805.2
GPIO2_1: RP805.4
GPIO2_2: RP805.6
GPIO2_3: RP805.8
GPIO2_4: RP806.2
GPIO2_5: RP806.4
GPIO2_6: RP806.6
GPIO2_7: RP806.8
GPIO2_8: R805.1
GPIO3_0: RP807.2
GPIO3_1: RP807.4
GPIO3_2: RP807.6
GPIO3_3: RP807.8
GPIO3_4: RP808.2
GPIO3_5: RP808.4
GPIO3_6: RP808.6
GPIO3_7: RP808.8
GPIO3_8: R807.1
GPIO4_0: RP809.2
GPIO4_1: RP809.4
GPIO4_2: RP809.6
GPIO4_3: RP809.8
GPIO4_4: RP810.2
GPIO4_5: RP810.4
GPIO4_6: RP810.6
GPIO4_7: RP810.8
GPIO4_8: R809.1
GPIO5_0: RP811.2
GPIO5_1: RP811.4
GPIO5_2: RP811.6
GPIO5_3: RP811.8
GPIO5_4: RP812.2
GPIO5_5: RP812.4
GPIO5_6: RP812.6
GPIO5_7: RP812.8
GPIO5_8: R811.1
GPIO6_0: RP813.2
GPIO6_1: RP813.4
GPIO6_2: RP813.6
GPIO6_3: RP813.8
GPIO6_4: RP814.2
GPIO6_5: RP814.4
GPIO6_6: RP814.6
GPIO6_7: RP814.8
GPIO6_8: R813.1
GPIO7_0: RP815.2
GPIO7_1: RP815.4
GPIO7_2: RP815.6
GPIO7_3: RP815.8
GPIO7_4: RP816.2
GPIO7_5: RP816.4
GPIO7_6: RP816.6
GPIO7_7: RP816.8
GPIO7_8: R815.1
GPIOC_0: RP819.2
GPIOC_1: RP819.4
GPIOC_2: RP819.6
GPIOC_3: RP819.8
GPIOC_4: RP820.2
GPIOC_5: RP820.4
GPIOC_6: RP820.6
GPIOC_7: RP820.8
GPIOC_8: RP821.2
GPIOC_9: RP821.4
GPIOC_10: RP821.6
GPIOC_11: RP821.8
GPIOC_12: RP822.2
GPIOC_13: RP822.4
GPIOC_14: RP822.6
GPIOC_15: RP822.8
GPIOOUT0_0: GPIO0.1(D0) RP801.1
GPIOOUT0_1: GPIO0.2(D1) RP801.3
GPIOOUT0_2: GPIO0.3(D2) RP801.5
GPIOOUT0_3: GPIO0.4(D3) RP801.7
GPIOOUT0_4: GPIO0.5(D4) RP802.1
GPIOOUT0_5: GPIO0.6(D5) RP802.3
GPIOOUT0_6: GPIO0.7(D6) RP802.5
GPIOOUT0_7: GPIO0.8(D7) RP802.7
GPIOOUT0_8: GPIO0.9(D8) R801.2
GPIOOUT0_G: GPIO0.10(GND) R802.2
GPIOOUT1_0: GPIO1.1(D0) RP803.1
GPIOOUT1_1: GPIO1.2(D1) RP803.3
GPIOOUT1_2: GPIO1.3(D2) RP803.5
GPIOOUT1_3: GPIO1.4(D3) RP803.7
GPIOOUT1_4: GPIO1.5(D4) RP804.1
GPIOOUT1_5: GPIO1.6(D5) RP804.3
GPIOOUT1_6: GPIO1.7(D6) RP804.5
GPIOOUT1_7: GPIO1.8(D7) RP804.7
GPIOOUT1_8: GPIO1.9(D8) R803.2
GPIOOUT1_G: GPIO1.10(GND) R804.2
GPIOOUT2_0: GPIO2.1(D0) RP805.1
GPIOOUT2_1: GPIO2.2(D1) RP805.3
GPIOOUT2_2: GPIO2.3(D2) RP805.5
GPIOOUT2_3: GPIO2.4(D3) RP805.7
GPIOOUT2_4: GPIO2.5(D4) RP806.1
GPIOOUT2_5: GPIO2.6(D5) RP806.3
GPIOOUT2_6: GPIO2.7(D6) RP806.5
GPIOOUT2_7: GPIO2.8(D7) RP806.7
GPIOOUT2_8: GPIO2.9(D8) R805.2
GPIOOUT2_G: GPIO2.10(GND) R806.2
GPIOOUT3_0: GPIO3.1(D0) RP807.1
GPIOOUT3_1: GPIO3.2(D1) RP807.3
GPIOOUT3_2: GPIO3.3(D2) RP807.5
GPIOOUT3_3: GPIO3.4(D3) RP807.7
GPIOOUT3_4: GPIO3.5(D4) RP808.1
GPIOOUT3_5: GPIO3.6(D5) RP808.3
GPIOOUT3_6: GPIO3.7(D6) RP808.5
GPIOOUT3_7: GPIO3.8(D7) RP808.7
GPIOOUT3_8: GPIO3.9(D8) R807.2
GPIOOUT3_G: GPIO3.10(GND) R808.2
GPIOOUT4_0: GPIO4.1(D0) RP809.1
GPIOOUT4_1: GPIO4.2(D1) RP809.3
GPIOOUT4_2: GPIO4.3(D2) RP809.5
GPIOOUT4_3: GPIO4.4(D3) RP809.7
GPIOOUT4_4: GPIO4.5(D4) RP810.1
GPIOOUT4_5: GPIO4.6(D5) RP810.3
GPIOOUT4_6: GPIO4.7(D6) RP810.5
GPIOOUT4_7: GPIO4.8(D7) RP810.7
GPIOOUT4_8: GPIO4.9(D8) R809.2
GPIOOUT4_G: GPIO4.10(GND) R810.2
GPIOOUT5_0: GPIO5.1(D0) RP811.1
GPIOOUT5_1: GPIO5.2(D1) RP811.3
GPIOOUT5_2: GPIO5.3(D2) RP811.5
GPIOOUT5_3: GPIO5.4(D3) RP811.7
GPIOOUT5_4: GPIO5.5(D4) RP812.1
GPIOOUT5_5: GPIO5.6(D5) RP812.3
GPIOOUT5_6: GPIO5.7(D6) RP812.5
GPIOOUT5_7: GPIO5.8(D7) RP812.7
GPIOOUT5_8: GPIO5.9(D8) R811.2
GPIOOUT5_G: GPIO5.10(GND) R812.2
GPIOOUT6_0: GPIO6.1(D0) RP813.1
GPIOOUT6_1: GPIO6.2(D1) RP813.3
GPIOOUT6_2: GPIO6.3(D2) RP813.5
GPIOOUT6_3: GPIO6.4(D3) RP813.7
GPIOOUT6_4: GPIO6.5(D4) RP814.1
GPIOOUT6_5: GPIO6.6(D5) RP814.3
GPIOOUT6_6: GPIO6.7(D6) RP814.5
GPIOOUT6_7: GPIO6.8(D7) RP814.7
GPIOOUT6_8: GPIO6.9(D8) R813.2
GPIOOUT6_G: GPIO6.10(GND) R814.2
GPIOOUT7_0: GPIO7.1(D0) RP815.1
GPIOOUT7_1: GPIO7.2(D1) RP815.3
GPIOOUT7_2: GPIO7.3(D2) RP815.5
GPIOOUT7_3: GPIO7.4(D3) RP815.7
GPIOOUT7_4: GPIO7.5(D4) RP816.1
GPIOOUT7_5: GPIO7.6(D5) RP816.3
GPIOOUT7_6: GPIO7.7(D6) RP816.5
GPIOOUT7_7: GPIO7.8(D7) RP816.7
GPIOOUT7_8: GPIO7.9(D8) R815.2
GPIOOUT7_G: GPIO7.10(GND) R816.2
GPIOOUTC_0: GPIO.1 RP819.1
GPIOOUTC_1: GPIO.3 RP819.3
GPIOOUTC_2: GPIO.5 RP819.5
GPIOOUTC_3: GPIO.7 RP819.7
GPIOOUTC_4: GPIO.9 RP820.1
GPIOOUTC_5: GPIO.11 RP820.3
GPIOOUTC_6: GPIO.13 RP820.5
GPIOOUTC_7: GPIO.15 RP820.7
GPIOOUTC_8: GPIO.17 RP821.1
GPIOOUTC_9: GPIO.19 RP821.3
GPIOOUTC_10: GPIO.21 RP821.5
GPIOOUTC_11: GPIO.23 RP821.7
GPIOOUTC_12: GPIO.25 RP822.1
GPIOOUTC_13: GPIO.27 RP822.3
GPIOOUTC_14: GPIO.29 RP822.5
GPIOOUTC_15: GPIO.31 RP822.7
IIC1_SCL: R819.1 R821.1
IIC1_SDA: R820.1 R822.1
IIC2_SCL: RP823.5 ZLG7290.4(SCL)  [also labelled KEYPAD_SCL]
IIC2_SDA: RP823.3 ZLG7290.6(SDA)  [also labelled KEYPAD_SDA]
KEYPAD_INT: RP823.1 ZLG7290.8(~{INT})
SPI2_MOSI: R818.1
TIM2_CH1: RP817.2
TIM2_CH2: RP817.4
TIM2_CH3: RP817.6
TIM2_CH4: RP817.8
TIM8_CH1: RP818.2
TIM8_CH2: RP818.4
TIM8_CH3: RP818.6
TIM8_CH4: RP818.8
TIM8_ETR: R817.2
USART1_RX: R824.2
USART1_TX: R823.2
NetLED801_1: LED801.1(A) RP823.7
NetLED801_2: LED801.2(K) ZLG7290.10(LED)
NetR817_1: R817.1 TIMER.10
NetR821_2: R821.2 SERIAL.1
NetR822_2: R822.2 SERIAL.3
NetR823_1: R823.1 SERIAL.2
NetR824_1: R824.1 SERIAL.4
NetRP817_1: RP817.1 TIMER.1
NetRP817_3: RP817.3 TIMER.3
NetRP817_5: RP817.5 TIMER.5
NetRP817_7: RP817.7 TIMER.7
NetRP818_1: RP818.1 TIMER.2
NetRP818_3: RP818.3 TIMER.4
NetRP818_5: RP818.5 TIMER.6
NetRP818_7: RP818.7 TIMER.8

### Notes on the sheet
- Labels drawn without touching a wire or pin: KEYPAD_INT

### Library data of the parts
AD9959 = AD9959_MASTER: DDS module
GPIO = DPORT16
LED801 = LEDR: RED LED
RP801-RP823 = Res Pack: Isolated Resistor Network
SERIAL = DPORT3
ZLG7290 = ZLG7290_MASTER: KEY module

## Sheet FPGAPort.SchDoc
size A
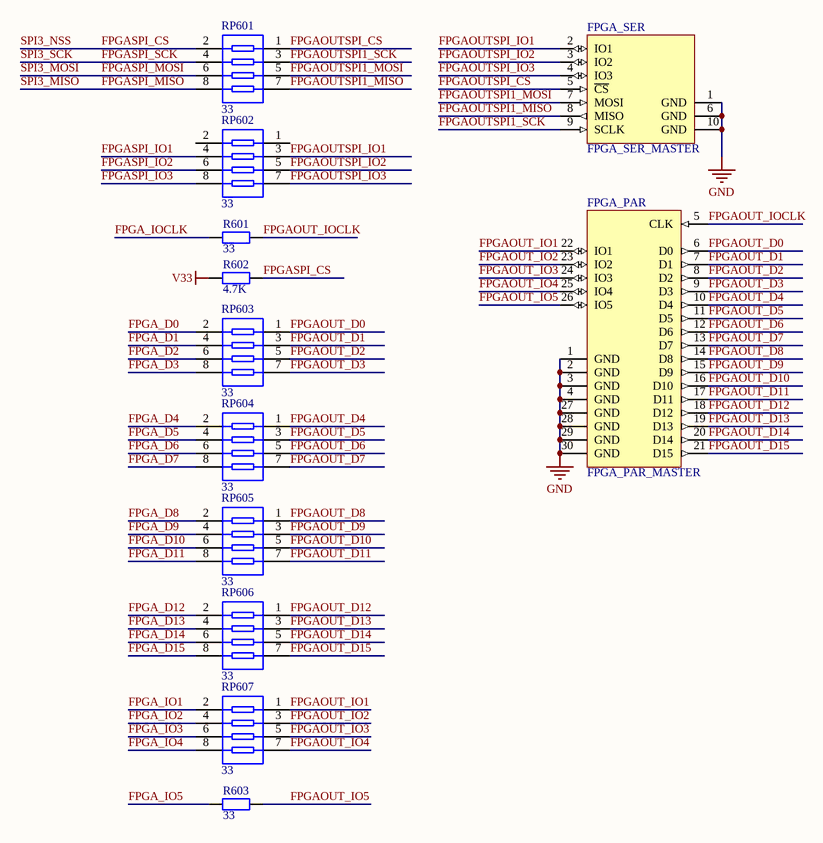
[diagram p4: FPGAPort.SchDoc]

### Parts
FPGA_PAR  FPGA_PAR_MASTER  [IDC30]
FPGA_SER  FPGA_SER_MASTER  [IDC10]
R601  value 33  [0603R]  (hidden comment: Resistor)
R602  value 4.7K  [0603R]  (hidden comment: Resistor)
R603  value 33  [0603R]  (hidden comment: Resistor)
RP601  value 33  [8P4R_0603]  (hidden comment: Res Pack)
RP602  value 33  [8P4R_0603]  (hidden comment: Res Pack)
RP603  value 33  [8P4R_0603]  (hidden comment: Res Pack)
RP604  value 33  [8P4R_0603]  (hidden comment: Res Pack)
RP605  value 33  [8P4R_0603]  (hidden comment: Res Pack)
RP606  value 33  [8P4R_0603]  (hidden comment: Res Pack)
RP607  value 33  [8P4R_0603]  (hidden comment: Res Pack)

### Nets
GND: FPGA_PAR.1(GND) FPGA_PAR.2(GND) FPGA_PAR.3(GND) FPGA_PAR.4(GND) FPGA_PAR.27(GND) FPGA_PAR.28(GND) FPGA_PAR.29(GND) FPGA_PAR.30(GND) FPGA_SER.1(GND) FPGA_SER.6(GND) FPGA_SER.10(GND)
V33: R602.1
FPGA_D0: RP603.2
FPGA_D1: RP603.4
FPGA_D2: RP603.6
FPGA_D3: RP603.8
FPGA_D4: RP604.2
FPGA_D5: RP604.4
FPGA_D6: RP604.6
FPGA_D7: RP604.8
FPGA_D8: RP605.2
FPGA_D9: RP605.4
FPGA_D10: RP605.6
FPGA_D11: RP605.8
FPGA_D12: RP606.2
FPGA_D13: RP606.4
FPGA_D14: RP606.6
FPGA_D15: RP606.8
FPGA_IO1: RP607.2
FPGA_IO2: RP607.4
FPGA_IO3: RP607.6
FPGA_IO4: RP607.8
FPGA_IO5: R603.1
FPGA_IOCLK: R601.1
FPGAOUT_D0: FPGA_PAR.6(D0) RP603.1
FPGAOUT_D1: FPGA_PAR.7(D1) RP603.3
FPGAOUT_D2: FPGA_PAR.8(D2) RP603.5
FPGAOUT_D3: FPGA_PAR.9(D3) RP603.7
FPGAOUT_D4: FPGA_PAR.10(D4) RP604.1
FPGAOUT_D5: FPGA_PAR.11(D5) RP604.3
FPGAOUT_D6: FPGA_PAR.12(D6) RP604.5
FPGAOUT_D7: FPGA_PAR.13(D7) RP604.7
FPGAOUT_D8: FPGA_PAR.14(D8) RP605.1
FPGAOUT_D9: FPGA_PAR.15(D9) RP605.3
FPGAOUT_D10: FPGA_PAR.16(D10) RP605.5
FPGAOUT_D11: FPGA_PAR.17(D11) RP605.7
FPGAOUT_D12: FPGA_PAR.18(D12) RP606.1
FPGAOUT_D13: FPGA_PAR.19(D13) RP606.3
FPGAOUT_D14: FPGA_PAR.20(D14) RP606.5
FPGAOUT_D15: FPGA_PAR.21(D15) RP606.7
FPGAOUT_IO1: FPGA_PAR.22(IO1) RP607.1
FPGAOUT_IO2: FPGA_PAR.23(IO2) RP607.3
FPGAOUT_IO3: FPGA_PAR.24(IO3) RP607.5
FPGAOUT_IO4: FPGA_PAR.25(IO4) RP607.7
FPGAOUT_IO5: FPGA_PAR.26(IO5) R603.2
FPGAOUT_IOCLK: FPGA_PAR.5(CLK) R601.2
FPGAOUTSPI1_MISO: FPGA_SER.8(MISO) RP601.7
FPGAOUTSPI1_MOSI: FPGA_SER.7(MOSI) RP601.5
FPGAOUTSPI1_SCK: FPGA_SER.9(SCLK) RP601.3
FPGAOUTSPI_CS: FPGA_SER.5(~{CS}) RP601.1
FPGAOUTSPI_IO1: FPGA_SER.2(IO1) RP602.3
FPGAOUTSPI_IO2: FPGA_SER.3(IO2) RP602.5
FPGAOUTSPI_IO3: FPGA_SER.4(IO3) RP602.7
FPGASPI_CS: R602.2 RP601.2  [also labelled SPI3_NSS]
FPGASPI_IO1: RP602.4
FPGASPI_IO2: RP602.6
FPGASPI_IO3: RP602.8
FPGASPI_MISO: RP601.8  [also labelled SPI3_MISO]
FPGASPI_MOSI: RP601.6  [also labelled SPI3_MOSI]
FPGASPI_SCK: RP601.4  [also labelled SPI3_SCK]

Not connected (* = marked no-connect by the designer): RP602 1 2

### Library data of the parts
FPGA_PAR = FPGA_PAR_MASTER: FPGA parallel port
FPGA_SER = FPGA_SER_MASTER: FPGA serial port
RP601-RP607 = Res Pack: Isolated Resistor Network

## Sheet USB.SchDoc
size A4
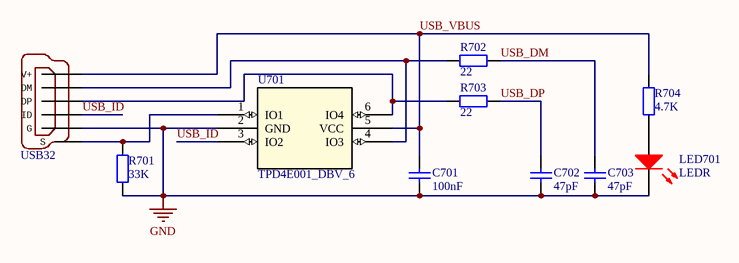
[diagram p5: USB.SchDoc]

### Parts
C701  value 100nF  [0603C]  (hidden comment: MLCC)
C702  value 47pF  [0603C]  (hidden comment: MLCC)
C703  value 47pF  [0603C]  (hidden comment: MLCC)
LED701  LEDR  [LED1206R]
R701  value 33K  [0603R]  (hidden comment: Resistor)
R702  value 22  [0603R]  (hidden comment: Resistor)
R703  value 22  [0603R]  (hidden comment: Resistor)
R704  value 4.7K  [0603R]  (hidden comment: Resistor)
U701  TPD4E001_DBV_6  [DBV6]
USB32  MICRO-USB  [USB-MICRO]  (value not drawn)

### Nets
GND: C701.1 C702.1 C703.1 LED701.2(K) R701.1 U701.2(GND) USB32.1(G)
USB_DM: C703.2 R702.2
USB_DP: C702.2 R703.2
USB_ID: U701.3(IO2) USB32.2(ID)
USB_VBUS: C701.2 R704.2 U701.5(VCC) USB32.5(V+)
NetLED701_1: LED701.1(A) R704.1
NetR701_2: R701.2 U701.1(IO1) USB32.6(S)
NetR702_1: R702.1 U701.4(IO3) USB32.4(DM)
NetR703_1: R703.1 U701.6(IO4) USB32.3(DP)

### Library data of the parts
LED701 = LEDR: RED LED
U701 = TPD4E001_DBV_6: Low-Capacitance 4-Channel ESD-Protection for High-Speed Data Interfaces; Vendor: Texas Instruments; PACKAGE_DESIGNATOR: DBV; PIN_COUNT: 6; FAMILY_NAME: ESD Solution; INDUSTRY_STD_PKG_TYPE: SOT-23; Manufacturer_Part_Number: tpd4e001_dbv_6; GENERIC_PART_NUMBER: TPD4E001; Datasheet URL: http://www.ti.com/lit/gpn/TPD4E001; Manufacturer: Texas Instruments; RefDes: RefDes; Type: DEV; Value: Value
USB32 = MICRO-USB: MICRO USB Connector

## Sheet CPLD.SchDoc
size A4
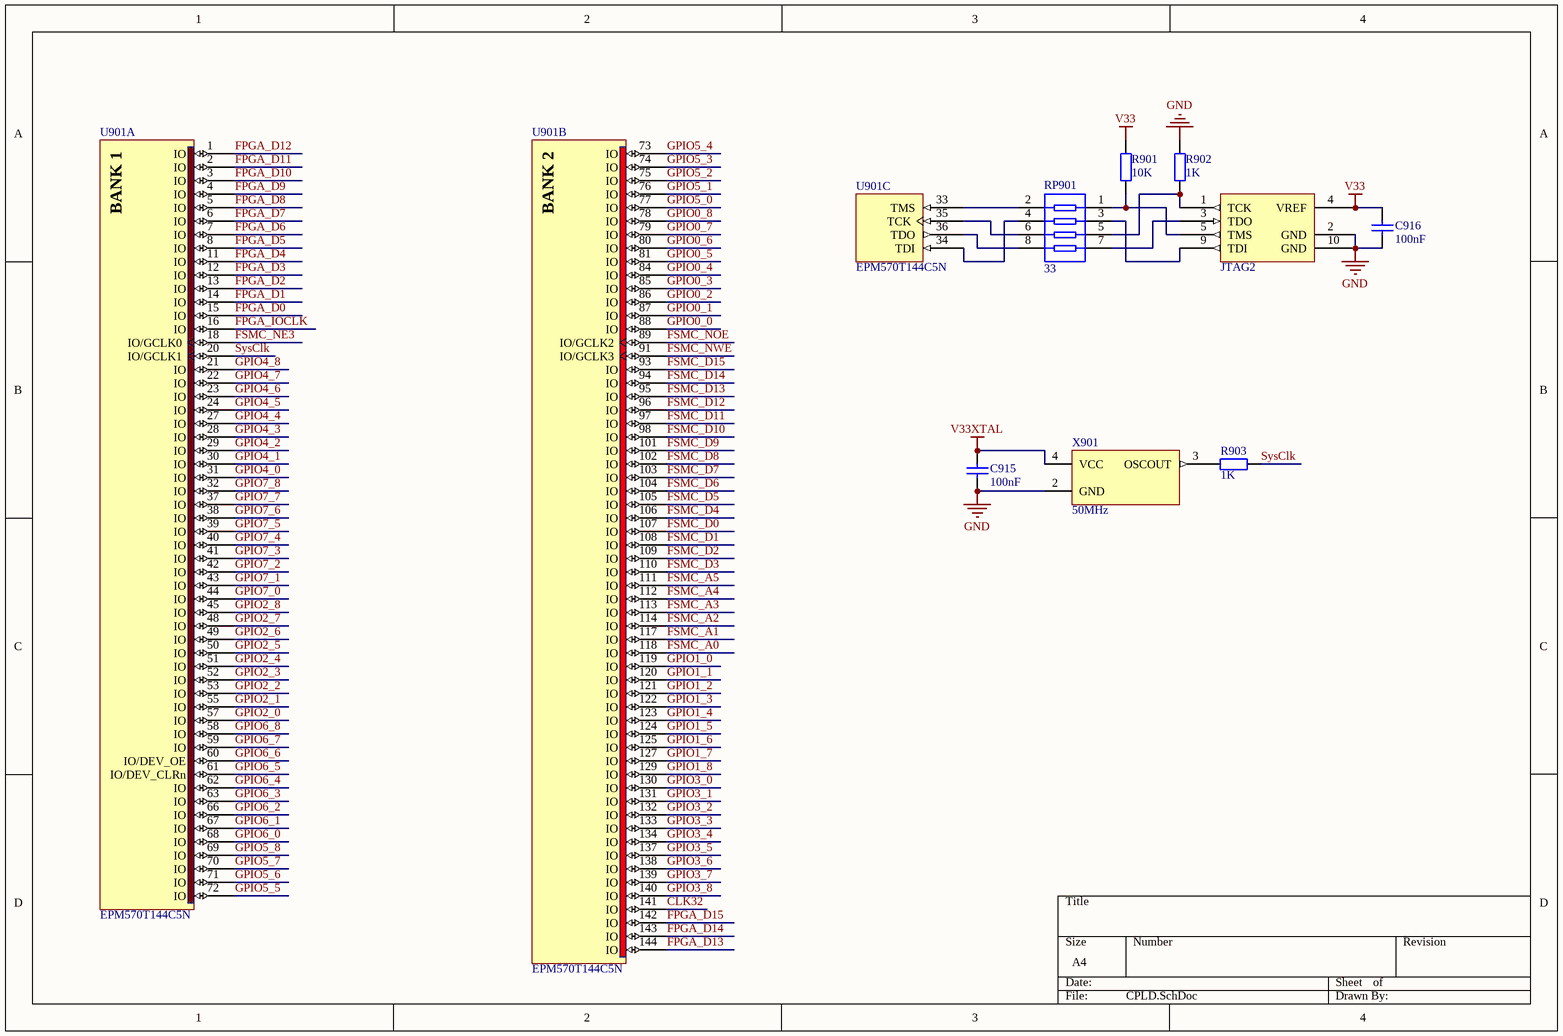
[diagram p6: CPLD.SchDoc]

### Parts
C915  value 100nF  [0603C]  (hidden comment: MLCC)
C916  value 100nF  [0805C]  (hidden comment: MLCC)
JTAG2  JTAG_ALTERA  [JTAG10]  (value not drawn)
R901  value 10K  [0603R]  (hidden comment: Resistor)
R902  value 1K  [0603R]  (hidden comment: Resistor)
R903  value 1K  [0603R]  (hidden comment: Resistor)
RP901  value 33  [8P4R_0603]  (hidden comment: Res Pack)
U901  EPM570T144C5N  [TQFP144_N]  (parts A,B,C of 5)
X901  value 50MHz  [XTAL-7050]  (hidden comment: Oscillator)

### Nets
GND: C915.1 C916.1 JTAG2.2(GND) JTAG2.10(GND) R902.2 X901.2(GND)
V33: C916.2 JTAG2.4(VREF) R901.2
V33XTAL: C915.2 X901.4(VCC)
CLK32: U901.141(IO)
FPGA_D0: U901.15(IO)
FPGA_D1: U901.14(IO)
FPGA_D2: U901.13(IO)
FPGA_D3: U901.12(IO)
FPGA_D4: U901.11(IO)
FPGA_D5: U901.8(IO)
FPGA_D6: U901.7(IO)
FPGA_D7: U901.6(IO)
FPGA_D8: U901.5(IO)
FPGA_D9: U901.4(IO)
FPGA_D10: U901.3(IO)
FPGA_D11: U901.2(IO)
FPGA_D12: U901.1(IO)
FPGA_D13: U901.144(IO)
FPGA_D14: U901.143(IO)
FPGA_D15: U901.142(IO)
FPGA_IOCLK: U901.16(IO)
FSMC_A0: U901.118(IO)
FSMC_A1: U901.117(IO)
FSMC_A2: U901.114(IO)
FSMC_A3: U901.113(IO)
FSMC_A4: U901.112(IO)
FSMC_A5: U901.111(IO)
FSMC_D0: U901.107(IO)
FSMC_D1: U901.108(IO)
FSMC_D2: U901.109(IO)
FSMC_D3: U901.110(IO)
FSMC_D4: U901.106(IO)
FSMC_D5: U901.105(IO)
FSMC_D6: U901.104(IO)
FSMC_D7: U901.103(IO)
FSMC_D8: U901.102(IO)
FSMC_D9: U901.101(IO)
FSMC_D10: U901.98(IO)
FSMC_D11: U901.97(IO)
FSMC_D12: U901.96(IO)
FSMC_D13: U901.95(IO)
FSMC_D14: U901.94(IO)
FSMC_D15: U901.93(IO)
FSMC_NE3: U901.18(IO/GCLK0)
FSMC_NOE: U901.89(IO/GCLK2)
FSMC_NWE: U901.91(IO/GCLK3)
GPIO0_0: U901.88(IO)
GPIO0_1: U901.87(IO)
GPIO0_2: U901.86(IO)
GPIO0_3: U901.85(IO)
GPIO0_4: U901.84(IO)
GPIO0_5: U901.81(IO)
GPIO0_6: U901.80(IO)
GPIO0_7: U901.79(IO)
GPIO0_8: U901.78(IO)
GPIO1_0: U901.119(IO)
GPIO1_1: U901.120(IO)
GPIO1_2: U901.121(IO)
GPIO1_3: U901.122(IO)
GPIO1_4: U901.123(IO)
GPIO1_5: U901.124(IO)
GPIO1_6: U901.125(IO)
GPIO1_7: U901.127(IO)
GPIO1_8: U901.129(IO)
GPIO2_0: U901.57(IO)
GPIO2_1: U901.55(IO)
GPIO2_2: U901.53(IO)
GPIO2_3: U901.52(IO)
GPIO2_4: U901.51(IO)
GPIO2_5: U901.50(IO)
GPIO2_6: U901.49(IO)
GPIO2_7: U901.48(IO)
GPIO2_8: U901.45(IO)
GPIO3_0: U901.130(IO)
GPIO3_1: U901.131(IO)
GPIO3_2: U901.132(IO)
GPIO3_3: U901.133(IO)
GPIO3_4: U901.134(IO)
GPIO3_5: U901.137(IO)
GPIO3_6: U901.138(IO)
GPIO3_7: U901.139(IO)
GPIO3_8: U901.140(IO)
GPIO4_0: U901.31(IO)
GPIO4_1: U901.30(IO)
GPIO4_2: U901.29(IO)
GPIO4_3: U901.28(IO)
GPIO4_4: U901.27(IO)
GPIO4_5: U901.24(IO)
GPIO4_6: U901.23(IO)
GPIO4_7: U901.22(IO)
GPIO4_8: U901.21(IO)
GPIO5_0: U901.77(IO)
GPIO5_1: U901.76(IO)
GPIO5_2: U901.75(IO)
GPIO5_3: U901.74(IO)
GPIO5_4: U901.73(IO)
GPIO5_5: U901.72(IO)
GPIO5_6: U901.71(IO)
GPIO5_7: U901.70(IO)
GPIO5_8: U901.69(IO)
GPIO6_0: U901.68(IO)
GPIO6_1: U901.67(IO)
GPIO6_2: U901.66(IO)
GPIO6_3: U901.63(IO)
GPIO6_4: U901.62(IO)
GPIO6_5: U901.61(IO/DEV_CLRn)
GPIO6_6: U901.60(IO/DEV_OE)
GPIO6_7: U901.59(IO)
GPIO6_8: U901.58(IO)
GPIO7_0: U901.44(IO)
GPIO7_1: U901.43(IO)
GPIO7_2: U901.42(IO)
GPIO7_3: U901.41(IO)
GPIO7_4: U901.40(IO)
GPIO7_5: U901.39(IO)
GPIO7_6: U901.38(IO)
GPIO7_7: U901.37(IO)
GPIO7_8: U901.32(IO)
SysClk: R903.2 U901.20(IO/GCLK1)
NetJTAG2_1: JTAG2.1(TCK) R902.1 RP901.5
NetJTAG2_3: JTAG2.3(TDO) RP901.7
NetJTAG2_5: JTAG2.5(TMS) R901.1 RP901.1
NetJTAG2_9: JTAG2.9(TDI) RP901.3
NetR903_1: R903.1 X901.3(OSCOUT)
NetRP901_2: RP901.2 U901.33(TMS)
NetRP901_4: RP901.4 U901.34(TDI)
NetRP901_6: RP901.6 U901.35(TCK)
NetRP901_8: RP901.8 U901.36(TDO)

### Notes on the sheet
- (in symbol EPM570T144C5N, part A) BANK 1
- (in symbol EPM570T144C5N, part B) BANK 2

### Library data of the parts
JTAG2 = JTAG_ALTERA: ALTERA JTAG port
RP901 = Res Pack: Isolated Resistor Network
U901 = EPM570T144C5N: as U901 on sheet Power; DatasheetVersion: ver1.8, Jul-2006; PackageVersion: ver16.3, Dec-2010; PackageReference: TQFP144; PackageDescription: 144-Pin Plastic Thin Quad Flat Pack (TQFP144) - Wire Bond; Code_JEDEC: MS-026-BFB; ComponentLink1Description: Manufacturer URL; ComponentLink1URL: http://www.altera.com/; ComponentLink2Description: Handbook; ComponentLink2URL: http://www.altera.com/literature/hb/max2/max2_mii5v1.pdf; ComponentLink3Description: Package Specification; ComponentLink3URL: http://www.altera.com/literature/ds/dspkg.pdf
X901 = Oscillator_50MHz

## Nets that join several sheets
GND: Power (80 pins), STM32 (25 pins), FSMC (7 pins), Ports (36 pins), FPGAPort (11 pins), USB (7 pins), CPLD (6 pins)
V33: Power (44 pins), STM32 (13 pins), FSMC (9 pins), Ports (9 pins), FPGAPort (R602.1), CPLD (C916.2 JTAG2.4 R901.2)
9959_CS: STM32 (U201.92), Ports (AD9959.8)
9959_IO0: STM32 (U201.94), Ports (AD9959.12 R818.2)
9959_IO1: STM32 (U201.26), Ports (AD9959.11)
9959_IO2: STM32 (U201.27), Ports (AD9959.14)
9959_IO3: STM32 (U201.28), Ports (AD9959.13)
9959_P0: STM32 (U201.7), Ports (AD9959.2)
9959_P1: STM32 (U201.11), Ports (AD9959.3)
9959_P2: STM32 (U201.13), Ports (AD9959.4)
9959_P3: STM32 (U201.12), Ports (AD9959.5)
9959_RESET: STM32 (U201.24), Ports (AD9959.15)
9959_SCLK: STM32 (U201.93), Ports (AD9959.9)
9959_UPDATE: STM32 (U201.25), Ports (AD9959.7)
BL_CTR: STM32 (U201.45), FSMC (BL_CTR.2 LCM502.23)
CLK32: STM32 (U201.29), CPLD (U901.141)
FPGA_D0: FPGAPort (RP603.2), CPLD (U901.15)
FPGA_D1: FPGAPort (RP603.4), CPLD (U901.14)
FPGA_D2: FPGAPort (RP603.6), CPLD (U901.13)
FPGA_D3: FPGAPort (RP603.8), CPLD (U901.12)
FPGA_D4: FPGAPort (RP604.2), CPLD (U901.11)
FPGA_D5: FPGAPort (RP604.4), CPLD (U901.8)
FPGA_D6: FPGAPort (RP604.6), CPLD (U901.7)
FPGA_D7: FPGAPort (RP604.8), CPLD (U901.6)
FPGA_D8: FPGAPort (RP605.2), CPLD (U901.5)
FPGA_D9: FPGAPort (RP605.4), CPLD (U901.4)
FPGA_D10: FPGAPort (RP605.6), CPLD (U901.3)
FPGA_D11: FPGAPort (RP605.8), CPLD (U901.2)
FPGA_D12: FPGAPort (RP606.2), CPLD (U901.1)
FPGA_D13: FPGAPort (RP606.4), CPLD (U901.144)
FPGA_D14: FPGAPort (RP606.6), CPLD (U901.143)
FPGA_D15: FPGAPort (RP606.8), CPLD (U901.142)
FPGA_IO1: STM32 (U201.128), FPGAPort (RP607.2)
FPGA_IO2: STM32 (U201.129), FPGAPort (RP607.4)
FPGA_IO3: STM32 (U201.130), FPGAPort (RP607.6)
FPGA_IO4: STM32 (U201.132), FPGAPort (RP607.8)
FPGA_IO5: STM32 (U201.131), FPGAPort (R603.1)
FPGA_IOCLK: FPGAPort (R601.1), CPLD (U901.16)
FPGASPI_CS: STM32 (U201.138), FPGAPort (R602.2 RP601.2)
FPGASPI_IO1: STM32 (U201.160), FPGAPort (RP602.4)
FPGASPI_IO2: STM32 (U201.157), FPGAPort (RP602.6)
FPGASPI_IO3: STM32 (U201.156), FPGAPort (RP602.8)
FPGASPI_MISO: STM32 (U201.162), FPGAPort (RP601.8)
FPGASPI_MOSI: STM32 (U201.163), FPGAPort (RP601.6)
FPGASPI_SCK: STM32 (U201.161), FPGAPort (RP601.4)
FSMC_A0: STM32 (U201.16), FSMC (U301.5 U401.25), CPLD (U901.118)
FSMC_A1: STM32 (U201.17), FSMC (LCM501.12 LCM502.2 U301.4 U401.24), CPLD (U901.117)
FSMC_A2: STM32 (U201.18), FSMC (U301.3 U401.23), CPLD (U901.114)
FSMC_A3: STM32 (U201.19), FSMC (U301.2 U401.22), CPLD (U901.113)
FSMC_A4: STM32 (U201.20), FSMC (U301.1 U401.21), CPLD (U901.112)
FSMC_A5: STM32 (U201.21), FSMC (U301.47 U401.20), CPLD (U901.111)
FSMC_A6: STM32 (U201.60), FSMC (U301.20 U401.19)
FSMC_A7: STM32 (U201.63), FSMC (U301.21 U401.18)
FSMC_A8: STM32 (U201.64), FSMC (U301.22 U401.8)
FSMC_A9: STM32 (U201.65), FSMC (U301.23 U401.7)
FSMC_A10: STM32 (U201.66), FSMC (U301.24 U401.6)
FSMC_A11: STM32 (U201.67), FSMC (U301.25 U401.5)
FSMC_A12: STM32 (U201.106), FSMC (U301.27 U401.4)
FSMC_A13: STM32 (U201.107), FSMC (U301.28 U401.3)
FSMC_A14: STM32 (U201.108), FSMC (U301.29 U401.2)
FSMC_A15: STM32 (U201.109), FSMC (U301.46 U401.1)
FSMC_A16: STM32 (U201.99), FSMC (U301.45 U401.48)
FSMC_A17: STM32 (U201.100), FSMC (U301.48 U401.17)
FSMC_A18: STM32 (U201.101), FSMC (U301.30 U401.16)
FSMC_A19: STM32 (U201.2), FSMC (U301.26 U401.9)
FSMC_A20: STM32 (U201.3), FSMC (U301.31 U401.10)
FSMC_A21: STM32 (U201.4), FSMC (U401.13)
FSMC_D0: STM32 (U201.104), FSMC (LCM501.16 LCM502.6 U301.8 U401.29), CPLD (U901.107)
FSMC_D1: STM32 (U201.105), FSMC (LCM501.17 LCM502.7 U301.9 U401.31), CPLD (U901.108)
FSMC_D2: STM32 (U201.142), FSMC (LCM501.18 LCM502.8 U301.10 U401.33), CPLD (U901.109)
FSMC_D3: STM32 (U201.143), FSMC (LCM501.19 LCM502.9 U301.11 U401.35), CPLD (U901.110)
FSMC_D4: STM32 (U201.68), FSMC (LCM501.20 LCM502.10 U301.14 U401.38), CPLD (U901.106)
FSMC_D5: STM32 (U201.69), FSMC (LCM501.21 LCM502.11 U301.15 U401.40), CPLD (U901.105)
FSMC_D6: STM32 (U201.70), FSMC (LCM501.22 LCM502.12 U301.16 U401.42), CPLD (U901.104)
FSMC_D7: STM32 (U201.73), FSMC (LCM501.23 LCM502.13 U301.17 U401.44), CPLD (U901.103)
FSMC_D8: STM32 (U201.74), FSMC (LCM501.24 LCM502.14 U301.32 U401.30), CPLD (U901.102)
FSMC_D9: STM32 (U201.75), FSMC (LCM501.25 LCM502.15 U301.33 U401.32), CPLD (U901.101)
FSMC_D10: STM32 (U201.76), FSMC (LCM501.26 LCM502.16 U301.34 U401.34), CPLD (U901.98)
FSMC_D11: STM32 (U201.77), FSMC (LCM501.27 LCM502.17 U301.35 U401.36), CPLD (U901.97)
FSMC_D12: STM32 (U201.78), FSMC (LCM501.28 LCM502.18 U301.38 U401.39), CPLD (U901.96)
FSMC_D13: STM32 (U201.96), FSMC (LCM501.29 LCM502.19 U301.39 U401.41), CPLD (U901.95)
FSMC_D14: STM32 (U201.97), FSMC (LCM501.30 LCM502.20 U301.40 U401.43), CPLD (U901.94)
FSMC_D15: STM32 (U201.98), FSMC (LCM501.31 LCM502.21 U301.41 U401.45), CPLD (U901.93)
FSMC_NBL0: STM32 (U201.169), FSMC (U301.42)
FSMC_NBL1: STM32 (U201.170), FSMC (U301.43)
FSMC_NE1: STM32 (U201.151), FSMC (U301.7)
FSMC_NE2: STM32 (U201.152), FSMC (U401.26)
FSMC_NE3: STM32 (U201.153), CPLD (U901.18)
FSMC_NE4: STM32 (U201.155), FSMC (LCM501.11 LCM502.1)
FSMC_NOE: STM32 (U201.146), FSMC (LCM501.14 LCM502.4 U301.44 U401.28), CPLD (U901.89)
FSMC_NWE: STM32 (U201.147), FSMC (LCM501.13 LCM502.3 U301.18 U401.11), CPLD (U901.91)
GPIO0_0: Ports (RP801.2), CPLD (U901.88)
GPIO0_1: Ports (RP801.4), CPLD (U901.87)
GPIO0_2: Ports (RP801.6), CPLD (U901.86)
GPIO0_3: Ports (RP801.8), CPLD (U901.85)
GPIO0_4: Ports (RP802.2), CPLD (U901.84)
GPIO0_5: Ports (RP802.4), CPLD (U901.81)
GPIO0_6: Ports (RP802.6), CPLD (U901.80)
GPIO0_7: Ports (RP802.8), CPLD (U901.79)
GPIO0_8: Ports (R801.1), CPLD (U901.78)
GPIO1_0: Ports (RP803.2), CPLD (U901.119)
GPIO1_1: Ports (RP803.4), CPLD (U901.120)
GPIO1_2: Ports (RP803.6), CPLD (U901.121)
GPIO1_3: Ports (RP803.8), CPLD (U901.122)
GPIO1_4: Ports (RP804.2), CPLD (U901.123)
GPIO1_5: Ports (RP804.4), CPLD (U901.124)
GPIO1_6: Ports (RP804.6), CPLD (U901.125)
GPIO1_7: Ports (RP804.8), CPLD (U901.127)
GPIO1_8: Ports (R803.1), CPLD (U901.129)
GPIO2_0: Ports (RP805.2), CPLD (U901.57)
GPIO2_1: Ports (RP805.4), CPLD (U901.55)
GPIO2_2: Ports (RP805.6), CPLD (U901.53)
GPIO2_3: Ports (RP805.8), CPLD (U901.52)
GPIO2_4: Ports (RP806.2), CPLD (U901.51)
GPIO2_5: Ports (RP806.4), CPLD (U901.50)
GPIO2_6: Ports (RP806.6), CPLD (U901.49)
GPIO2_7: Ports (RP806.8), CPLD (U901.48)
GPIO2_8: Ports (R805.1), CPLD (U901.45)
GPIO3_0: Ports (RP807.2), CPLD (U901.130)
GPIO3_1: Ports (RP807.4), CPLD (U901.131)
GPIO3_2: Ports (RP807.6), CPLD (U901.132)
GPIO3_3: Ports (RP807.8), CPLD (U901.133)
GPIO3_4: Ports (RP808.2), CPLD (U901.134)
GPIO3_5: Ports (RP808.4), CPLD (U901.137)
GPIO3_6: Ports (RP808.6), CPLD (U901.138)
GPIO3_7: Ports (RP808.8), CPLD (U901.139)
GPIO3_8: Ports (R807.1), CPLD (U901.140)
GPIO4_0: Ports (RP809.2), CPLD (U901.31)
GPIO4_1: Ports (RP809.4), CPLD (U901.30)
GPIO4_2: Ports (RP809.6), CPLD (U901.29)
GPIO4_3: Ports (RP809.8), CPLD (U901.28)
GPIO4_4: Ports (RP810.2), CPLD (U901.27)
GPIO4_5: Ports (RP810.4), CPLD (U901.24)
GPIO4_6: Ports (RP810.6), CPLD (U901.23)
GPIO4_7: Ports (RP810.8), CPLD (U901.22)
GPIO4_8: Ports (R809.1), CPLD (U901.21)
GPIO5_0: Ports (RP811.2), CPLD (U901.77)
GPIO5_1: Ports (RP811.4), CPLD (U901.76)
GPIO5_2: Ports (RP811.6), CPLD (U901.75)
GPIO5_3: Ports (RP811.8), CPLD (U901.74)
GPIO5_4: Ports (RP812.2), CPLD (U901.73)
GPIO5_5: Ports (RP812.4), CPLD (U901.72)
GPIO5_6: Ports (RP812.6), CPLD (U901.71)
GPIO5_7: Ports (RP812.8), CPLD (U901.70)
GPIO5_8: Ports (R811.1), CPLD (U901.69)
GPIO6_0: Ports (RP813.2), CPLD (U901.68)
GPIO6_1: Ports (RP813.4), CPLD (U901.67)
GPIO6_2: Ports (RP813.6), CPLD (U901.66)
GPIO6_3: Ports (RP813.8), CPLD (U901.63)
GPIO6_4: Ports (RP814.2), CPLD (U901.62)
GPIO6_5: Ports (RP814.4), CPLD (U901.61)
GPIO6_6: Ports (RP814.6), CPLD (U901.60)
GPIO6_7: Ports (RP814.8), CPLD (U901.59)
GPIO6_8: Ports (R813.1), CPLD (U901.58)
GPIO7_0: Ports (RP815.2), CPLD (U901.44)
GPIO7_1: Ports (RP815.4), CPLD (U901.43)
GPIO7_2: Ports (RP815.6), CPLD (U901.42)
GPIO7_3: Ports (RP815.8), CPLD (U901.41)
GPIO7_4: Ports (RP816.2), CPLD (U901.40)
GPIO7_5: Ports (RP816.4), CPLD (U901.39)
GPIO7_6: Ports (RP816.6), CPLD (U901.38)
GPIO7_7: Ports (RP816.8), CPLD (U901.37)
GPIO7_8: Ports (R815.1), CPLD (U901.32)
GPIOC_0: STM32 (U201.32), Ports (RP819.2)
GPIOC_1: STM32 (U201.33), Ports (RP819.4)
GPIOC_2: STM32 (U201.34), Ports (RP819.6)
GPIOC_3: STM32 (U201.35), Ports (RP819.8)
GPIOC_4: STM32 (U201.54), Ports (RP820.2)
GPIOC_5: STM32 (U201.55), Ports (RP820.4)
GPIOC_6: STM32 (U201.115), Ports (RP820.6)
GPIOC_7: STM32 (U201.116), Ports (RP820.8)
GPIOC_8: STM32 (U201.117), Ports (RP821.2)
GPIOC_9: STM32 (U201.118), Ports (RP821.4)
GPIOC_10: STM32 (U201.139), Ports (RP821.6)
GPIOC_11: STM32 (U201.140), Ports (RP821.8)
GPIOC_12: STM32 (U201.141), Ports (RP822.2)
GPIOC_13: STM32 (U201.8), Ports (RP822.4)
GPIOC_14: STM32 (U201.9), Ports (RP822.6)
GPIOC_15: STM32 (U201.10), Ports (RP822.8)
IIC1_SCL: STM32 (U201.167), Ports (R819.1 R821.1)
IIC1_SDA: STM32 (U201.168), Ports (R820.1 R822.1)
IIC2_SCL: STM32 (U201.79), Ports (RP823.5 ZLG7290.4)
IIC2_SDA: STM32 (U201.80), Ports (RP823.3 ZLG7290.6)
IIC3_SCL: STM32 (U201.84), FSMC (LCM501.32 LCM502.34 R502.1)
IIC3_SDA: STM32 (U201.85), FSMC (LCM501.33 LCM502.30 R501.1)
KEYPAD_INT: STM32 (U201.119), Ports (RP823.1 ZLG7290.8)
PERIPHERAL_RESET: STM32 (U201.83), FSMC (LCM501.15 LCM502.5 U401.12)
SPI2_MOSI: STM32 (U201.95), Ports (R818.1)
TIM2_CH1: STM32 (U201.40), Ports (RP817.2)
TIM2_CH2: STM32 (U201.41), Ports (RP817.4)
TIM2_CH3: STM32 (U201.42), Ports (RP817.6)
TIM2_CH4: STM32 (U201.47), Ports (RP817.8)
TIM8_CH1: STM32 (U201.174), Ports (RP818.2)
TIM8_CH2: STM32 (U201.175), Ports (RP818.4)
TIM8_CH3: STM32 (U201.176), Ports (RP818.6)
TIM8_CH4: STM32 (U201.133), Ports (RP818.8)
TIM8_ETR: STM32 (U201.134), Ports (R817.2)
USART1_RX: STM32 (U201.165), Ports (R824.2)
USART1_TX: STM32 (U201.164), Ports (R823.2)
USB_DM: STM32 (U201.122), USB (C703.2 R702.2)
USB_DP: STM32 (U201.123), USB (C702.2 R703.2)
USB_ID: STM32 (U201.121), USB (U701.3 USB32.2)
USB_VBUS: Power (D102.1), STM32 (U201.120), USB (C701.2 R704.2 U701.5 USB32.5)